# Altium project JEAC605UM-FTTSC-2.0.PRJPCB (part 1 of 3)
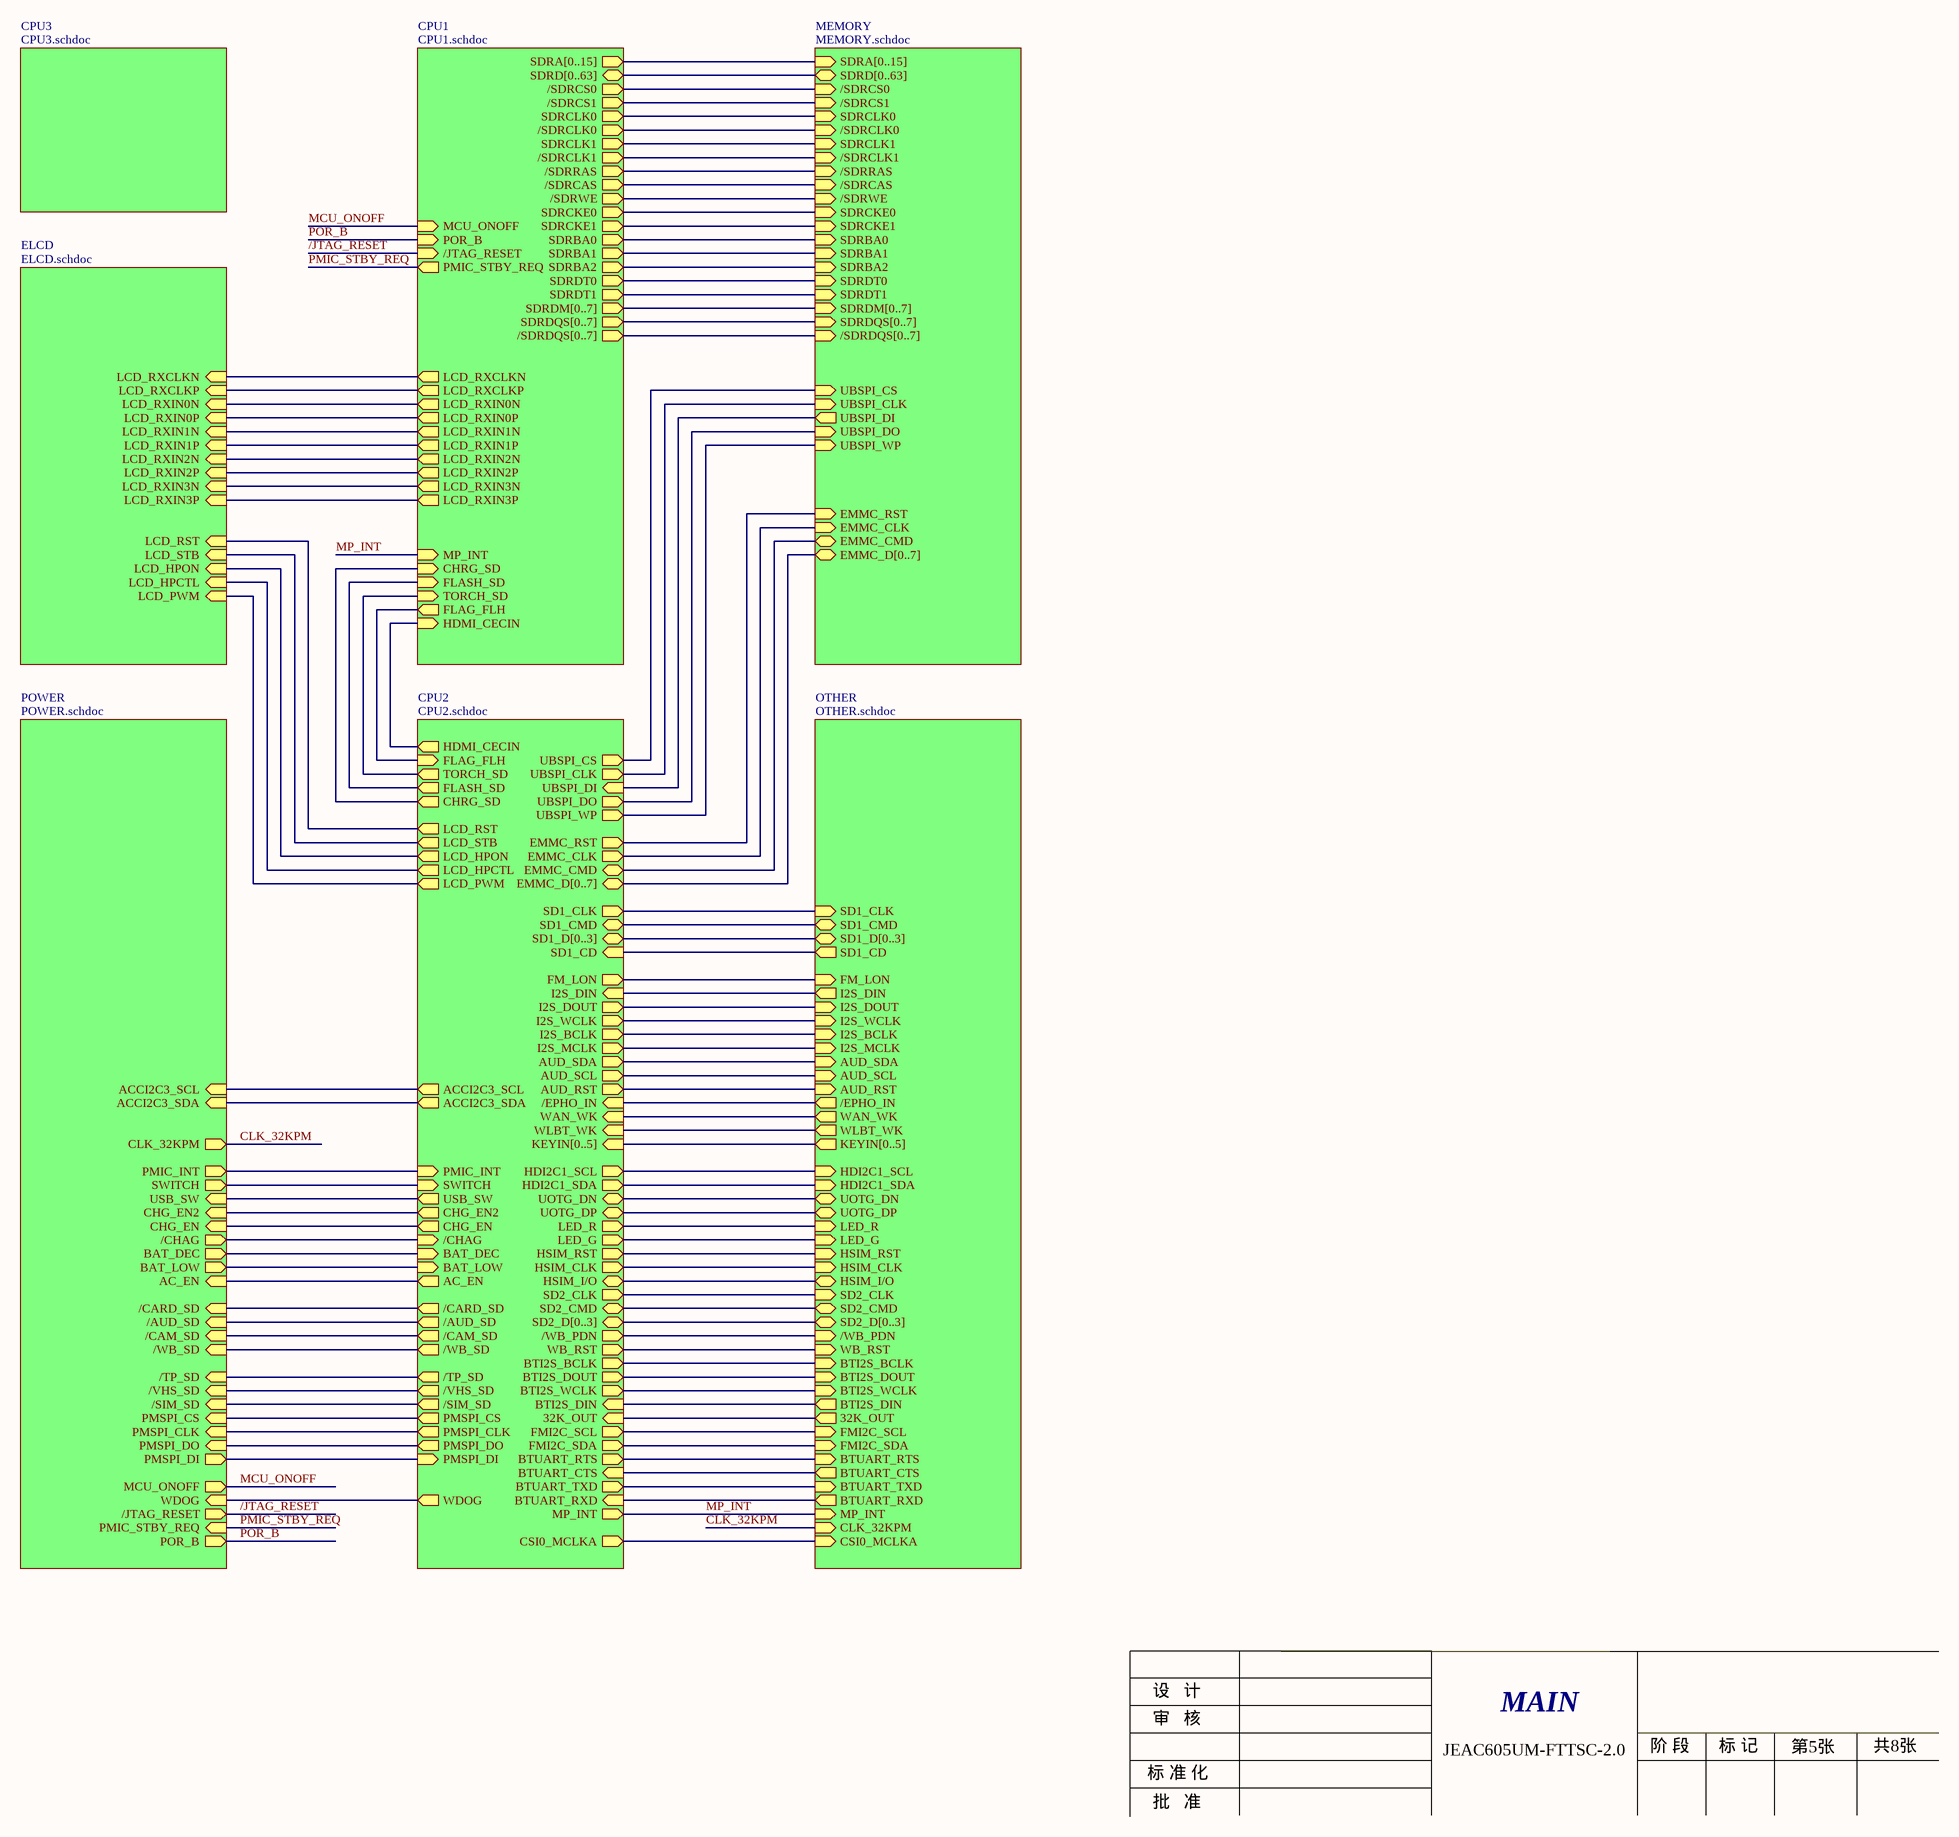
[diagram p0: MAIN.schdoc]
8 sheets, 865 parts. Net scope: hierarchical (ports join the sheet entries above them; power ports are global).
Sheets:
  MAIN.schdoc
    MEMORY = MEMORY.schdoc
    CPU1 = CPU1.schdoc
    CPU2 = CPU2.schdoc
    OTHER = OTHER.schdoc
    ELCD = ELCD.schdoc
    CPU3 = CPU3.schdoc
    POWER = POWER.schdoc

## Sheet MAIN.schdoc
size C; SheetNumber: 5; SheetTotal: 8

### Sub-sheets
CPU1 = CPU1.schdoc: /SDRCS0 (out), SDRCLK1 (out), /SDRCAS (out), /SDRRAS (out), /SDRWE (out), /SDRDQS[0..7] (out), /SDRCLK1 (out), SDRBA2 (out), SDRDQS[0..7] (out), SDRDM[0..7] (out), SDRCKE1 (out), SDRCKE0 (out), SDRA[0..15] (out), SDRD[0..63] (bidir), SDRBA0 (out), SDRBA1 (out), /JTAG_RESET (in), POR_B (in), SDRDT0 (out), SDRDT1 (out), PMIC_STBY_REQ (out), SDRCLK0 (out), /SDRCLK0 (out), LCD_RXCLKN (out), LCD_RXCLKP (out), LCD_RXIN0N (out), LCD_RXIN0P (out), LCD_RXIN1N (out), LCD_RXIN1P (out), LCD_RXIN2N (out), LCD_RXIN2P (out), LCD_RXIN3N (out), LCD_RXIN3P (out), HDMI_CECIN (in), /SDRCS1 (out), MCU_ONOFF (in), FLASH_SD (in), TORCH_SD (in), FLAG_FLH (out), CHRG_SD (in), MP_INT (in)  | Description: CPU1
CPU2 = CPU2.schdoc: /CAM_SD (out), /AUD_SD (out), /EPHO_IN (in), SWITCH (in), AUD_SDA (out), KEYIN[0..5] (in), SD2_CMD (bidir), SD2_D[0..3] (bidir), AUD_RST (out), UOTG_DN (bidir), AUD_SCL (out), I2S_DOUT (out), I2S_WCLK (out), UOTG_DP (bidir), /WB_PDN (out), /WB_SD (out), WB_RST (out), I2S_BCLK (out), I2S_MCLK (out), SD2_CLK (out), SD1_D[0..3] (bidir), SD1_CMD (bidir), SD1_CD (in), PMIC_INT (in), /VHS_SD (out), /TP_SD (out), SD1_CLK (out), WDOG (out), UBSPI_CS (out), UBSPI_DI (in), UBSPI_CLK (out), UBSPI_DO (out), UBSPI_WP (out), HSIM_RST (out), HSIM_I/O (bidir), HSIM_CLK (out), /CHAG (in), CHG_EN (out), /SIM_SD (out), LED_R (out), LED_G (out), BAT_DEC (in), EMMC_CLK (out), EMMC_CMD (bidir), EMMC_D[0..7] (bidir), EMMC_RST (out), USB_SW (out), CHG_EN2 (out), LCD_RST (out), LCD_HPON (out), LCD_STB (out), LCD_HPCTL (out), LCD_PWM (out), BTI2S_BCLK (out), BTI2S_DOUT (out), BTI2S_WCLK (out), BTI2S_DIN (in), FMI2C_SCL (out), FMI2C_SDA (out), /CARD_SD (out), 32K_OUT (in), WAN_WK (in), HDMI_CECIN (out), HDI2C1_SDA (out), HDI2C1_SCL (out), WLBT_WK (in), I2S_DIN (in), ACCI2C3_SCL (out), ACCI2C3_SDA (out), BAT_LOW (in), BTUART_RTS (out), BTUART_CTS (in), BTUART_TXD (out), BTUART_RXD (in), FM_LON (out), PMSPI_CS (out), PMSPI_CLK (out), PMSPI_DO (out), PMSPI_DI (in), AC_EN (out), FLAG_FLH (in), TORCH_SD (out), FLASH_SD (out), CHRG_SD (out), MP_INT (out), CSI0_MCLKA (out)  | Description: CPU2
CPU3 = CPU3.schdoc: no entries  | Description: epaper
ELCD = ELCD.schdoc: LCD_RXIN2P (in), LCD_RXIN3P (in), LCD_RXCLKP (in), LCD_RST (in), LCD_STB (in), LCD_PWM (in), LCD_RXCLKN (in), LCD_RXIN1N (in), LCD_RXIN1P (in), LCD_RXIN2N (in), LCD_RXIN3N (in), LCD_HPON (in), LCD_HPCTL (in), LCD_RXIN0N (in), LCD_RXIN0P (in)  | Description: epaper
MEMORY = MEMORY.schdoc: /SDRCS0 (in), /SDRRAS (in), /SDRCAS (in), /SDRCLK1 (in), SDRCLK1 (in), SDRDQS[0..7] (in), SDRDM[0..7] (in), /SDRWE (in), SDRCKE0 (in), SDRCKE1 (in), SDRA[0..15] (in), SDRD[0..63] (bidir), SDRBA0 (in), SDRBA1 (in), UBSPI_DI (out), UBSPI_CLK (in), UBSPI_WP (in), UBSPI_DO (in), UBSPI_CS (in), SDRBA2 (in), /SDRDQS[0..7] (in), /SDRCS1 (in), SDRDT0 (in), SDRDT1 (in), SDRCLK0 (in), /SDRCLK0 (in), EMMC_RST (in), EMMC_CLK (in), EMMC_D[0..7] (bidir), EMMC_CMD (bidir)  | Description: MEMORY
OTHER = OTHER.schdoc: AUD_SCL (in), SD2_D[0..3] (bidir), SD2_CMD (bidir), SD2_CLK (in), AUD_SDA (in), /EPHO_IN (out), KEYIN[0..5] (out), WB_RST (in), UOTG_DN (bidir), /WB_PDN (in), I2S_WCLK (in), I2S_BCLK (in), I2S_MCLK (in), I2S_DOUT (in), UOTG_DP (bidir), AUD_RST (in), SD1_CLK (in), SD1_D[0..3] (bidir), SD1_CMD (bidir), SD1_CD (out), HSIM_RST (in), HSIM_CLK (in), HSIM_I/O (bidir), LED_R (in), LED_G (in), BTI2S_BCLK (in), BTI2S_DOUT (in), BTI2S_WCLK (in), BTI2S_DIN (out), FMI2C_SCL (in), FMI2C_SDA (in), 32K_OUT (out), WAN_WK (out), WLBT_WK (out), I2S_DIN (out), BTUART_RTS (in), BTUART_CTS (out), BTUART_TXD (in), BTUART_RXD (out), FM_LON (in), CLK_32KPM (in), MP_INT (in), CSI0_MCLKA (in), HDI2C1_SCL (in), HDI2C1_SDA (in)  | Description: audio&CARD&KEY
POWER = POWER.schdoc: /JTAG_RESET (out), PMIC_STBY_REQ (in), POR_B (out), WDOG (in), SWITCH (out), /CAM_SD (in), /AUD_SD (in), /WB_SD (in), /TP_SD (in), /VHS_SD (in), PMIC_INT (out), /CHAG (out), CHG_EN (in), /SIM_SD (in), BAT_DEC (out), USB_SW (in), CHG_EN2 (in), /CARD_SD (in), MCU_ONOFF (out), ACCI2C3_SCL (in), ACCI2C3_SDA (in), BAT_LOW (out), PMSPI_DO (in), PMSPI_CLK (in), PMSPI_CS (in), PMSPI_DI (out), CLK_32KPM (out), AC_EN (in)  | Description: epaper

### Nets
32K_OUT: sheet CPU2/32K_OUT, sheet OTHER/32K_OUT
/AUD_SD: sheet CPU2//AUD_SD, sheet POWER//AUD_SD
/CAM_SD: sheet CPU2//CAM_SD, sheet POWER//CAM_SD
/CARD_SD: sheet CPU2//CARD_SD, sheet POWER//CARD_SD
/CHAG: sheet CPU2//CHAG, sheet POWER//CHAG
/EPHO_IN: sheet CPU2//EPHO_IN, sheet OTHER//EPHO_IN
/JTAG_RESET: sheet CPU1//JTAG_RESET, sheet POWER//JTAG_RESET
/SDRCAS: sheet MEMORY//SDRCAS, sheet CPU1//SDRCAS
/SDRCLK0: sheet MEMORY//SDRCLK0, sheet CPU1//SDRCLK0
/SDRCLK1: sheet MEMORY//SDRCLK1, sheet CPU1//SDRCLK1
/SDRCS0: sheet MEMORY//SDRCS0, sheet CPU1//SDRCS0
/SDRCS1: sheet MEMORY//SDRCS1, sheet CPU1//SDRCS1
/SDRRAS: sheet MEMORY//SDRRAS, sheet CPU1//SDRRAS
/SDRWE: sheet MEMORY//SDRWE, sheet CPU1//SDRWE
/SIM_SD: sheet CPU2//SIM_SD, sheet POWER//SIM_SD
/TP_SD: sheet CPU2//TP_SD, sheet POWER//TP_SD
/VHS_SD: sheet CPU2//VHS_SD, sheet POWER//VHS_SD
/WB_PDN: sheet CPU2//WB_PDN, sheet OTHER//WB_PDN
/WB_SD: sheet CPU2//WB_SD, sheet POWER//WB_SD
AC_EN: sheet CPU2/AC_EN, sheet POWER/AC_EN
ACCI2C3_SCL: sheet CPU2/ACCI2C3_SCL, sheet POWER/ACCI2C3_SCL
ACCI2C3_SDA: sheet CPU2/ACCI2C3_SDA, sheet POWER/ACCI2C3_SDA
AUD_RST: sheet CPU2/AUD_RST, sheet OTHER/AUD_RST
AUD_SCL: sheet CPU2/AUD_SCL, sheet OTHER/AUD_SCL
AUD_SDA: sheet CPU2/AUD_SDA, sheet OTHER/AUD_SDA
BAT_DEC: sheet CPU2/BAT_DEC, sheet POWER/BAT_DEC
BAT_LOW: sheet CPU2/BAT_LOW, sheet POWER/BAT_LOW
BTI2S_BCLK: sheet CPU2/BTI2S_BCLK, sheet OTHER/BTI2S_BCLK
BTI2S_DIN: sheet CPU2/BTI2S_DIN, sheet OTHER/BTI2S_DIN
BTI2S_DOUT: sheet CPU2/BTI2S_DOUT, sheet OTHER/BTI2S_DOUT
BTI2S_WCLK: sheet CPU2/BTI2S_WCLK, sheet OTHER/BTI2S_WCLK
BTUART_CTS: sheet CPU2/BTUART_CTS, sheet OTHER/BTUART_CTS
BTUART_RTS: sheet CPU2/BTUART_RTS, sheet OTHER/BTUART_RTS
BTUART_RXD: sheet CPU2/BTUART_RXD, sheet OTHER/BTUART_RXD
BTUART_TXD: sheet CPU2/BTUART_TXD, sheet OTHER/BTUART_TXD
CHG_EN: sheet CPU2/CHG_EN, sheet POWER/CHG_EN
CHG_EN2: sheet CPU2/CHG_EN2, sheet POWER/CHG_EN2
CHRG_SD: sheet CPU1/CHRG_SD, sheet CPU2/CHRG_SD
CLK_32KPM: sheet OTHER/CLK_32KPM, sheet POWER/CLK_32KPM
CSI0_MCLKA: sheet CPU2/CSI0_MCLKA, sheet OTHER/CSI0_MCLKA
EMMC_CLK: sheet MEMORY/EMMC_CLK, sheet CPU2/EMMC_CLK
EMMC_CMD: sheet MEMORY/EMMC_CMD, sheet CPU2/EMMC_CMD
EMMC_RST: sheet MEMORY/EMMC_RST, sheet CPU2/EMMC_RST
FLAG_FLH: sheet CPU1/FLAG_FLH, sheet CPU2/FLAG_FLH
FLASH_SD: sheet CPU1/FLASH_SD, sheet CPU2/FLASH_SD
FM_LON: sheet CPU2/FM_LON, sheet OTHER/FM_LON
FMI2C_SCL: sheet CPU2/FMI2C_SCL, sheet OTHER/FMI2C_SCL
FMI2C_SDA: sheet CPU2/FMI2C_SDA, sheet OTHER/FMI2C_SDA
HDI2C1_SCL: sheet CPU2/HDI2C1_SCL, sheet OTHER/HDI2C1_SCL
HDI2C1_SDA: sheet CPU2/HDI2C1_SDA, sheet OTHER/HDI2C1_SDA
HDMI_CECIN: sheet CPU1/HDMI_CECIN, sheet CPU2/HDMI_CECIN
HSIM_CLK: sheet CPU2/HSIM_CLK, sheet OTHER/HSIM_CLK
HSIM_I/O: sheet CPU2/HSIM_I/O, sheet OTHER/HSIM_I/O
HSIM_RST: sheet CPU2/HSIM_RST, sheet OTHER/HSIM_RST
I2S_BCLK: sheet CPU2/I2S_BCLK, sheet OTHER/I2S_BCLK
I2S_DIN: sheet CPU2/I2S_DIN, sheet OTHER/I2S_DIN
I2S_DOUT: sheet CPU2/I2S_DOUT, sheet OTHER/I2S_DOUT
I2S_MCLK: sheet CPU2/I2S_MCLK, sheet OTHER/I2S_MCLK
I2S_WCLK: sheet CPU2/I2S_WCLK, sheet OTHER/I2S_WCLK
LCD_HPCTL: sheet CPU2/LCD_HPCTL, sheet ELCD/LCD_HPCTL
LCD_HPON: sheet CPU2/LCD_HPON, sheet ELCD/LCD_HPON
LCD_PWM: sheet CPU2/LCD_PWM, sheet ELCD/LCD_PWM
LCD_RST: sheet CPU2/LCD_RST, sheet ELCD/LCD_RST
LCD_RXCLKN: sheet CPU1/LCD_RXCLKN, sheet ELCD/LCD_RXCLKN
LCD_RXCLKP: sheet CPU1/LCD_RXCLKP, sheet ELCD/LCD_RXCLKP
LCD_RXIN0N: sheet CPU1/LCD_RXIN0N, sheet ELCD/LCD_RXIN0N
LCD_RXIN0P: sheet CPU1/LCD_RXIN0P, sheet ELCD/LCD_RXIN0P
LCD_RXIN1N: sheet CPU1/LCD_RXIN1N, sheet ELCD/LCD_RXIN1N
LCD_RXIN1P: sheet CPU1/LCD_RXIN1P, sheet ELCD/LCD_RXIN1P
LCD_RXIN2N: sheet CPU1/LCD_RXIN2N, sheet ELCD/LCD_RXIN2N
LCD_RXIN2P: sheet CPU1/LCD_RXIN2P, sheet ELCD/LCD_RXIN2P
LCD_RXIN3N: sheet CPU1/LCD_RXIN3N, sheet ELCD/LCD_RXIN3N
LCD_RXIN3P: sheet CPU1/LCD_RXIN3P, sheet ELCD/LCD_RXIN3P
LCD_STB: sheet CPU2/LCD_STB, sheet ELCD/LCD_STB
LED_G: sheet CPU2/LED_G, sheet OTHER/LED_G
LED_R: sheet CPU2/LED_R, sheet OTHER/LED_R
MCU_ONOFF: sheet CPU1/MCU_ONOFF, sheet POWER/MCU_ONOFF
MP_INT: sheet CPU1/MP_INT, sheet CPU2/MP_INT, sheet OTHER/MP_INT
PMIC_INT: sheet CPU2/PMIC_INT, sheet POWER/PMIC_INT
PMIC_STBY_REQ: sheet CPU1/PMIC_STBY_REQ, sheet POWER/PMIC_STBY_REQ
PMSPI_CLK: sheet CPU2/PMSPI_CLK, sheet POWER/PMSPI_CLK
PMSPI_CS: sheet CPU2/PMSPI_CS, sheet POWER/PMSPI_CS
PMSPI_DI: sheet CPU2/PMSPI_DI, sheet POWER/PMSPI_DI
PMSPI_DO: sheet CPU2/PMSPI_DO, sheet POWER/PMSPI_DO
POR_B: sheet CPU1/POR_B, sheet POWER/POR_B
SD1_CD: sheet CPU2/SD1_CD, sheet OTHER/SD1_CD
SD1_CLK: sheet CPU2/SD1_CLK, sheet OTHER/SD1_CLK
SD1_CMD: sheet CPU2/SD1_CMD, sheet OTHER/SD1_CMD
SD2_CLK: sheet CPU2/SD2_CLK, sheet OTHER/SD2_CLK
SD2_CMD: sheet CPU2/SD2_CMD, sheet OTHER/SD2_CMD
SDRBA0: sheet MEMORY/SDRBA0, sheet CPU1/SDRBA0
SDRBA1: sheet MEMORY/SDRBA1, sheet CPU1/SDRBA1
SDRBA2: sheet MEMORY/SDRBA2, sheet CPU1/SDRBA2
SDRCKE0: sheet MEMORY/SDRCKE0, sheet CPU1/SDRCKE0
SDRCKE1: sheet MEMORY/SDRCKE1, sheet CPU1/SDRCKE1
SDRCLK0: sheet MEMORY/SDRCLK0, sheet CPU1/SDRCLK0
SDRCLK1: sheet MEMORY/SDRCLK1, sheet CPU1/SDRCLK1
SDRDT0: sheet MEMORY/SDRDT0, sheet CPU1/SDRDT0
SDRDT1: sheet MEMORY/SDRDT1, sheet CPU1/SDRDT1
SWITCH: sheet CPU2/SWITCH, sheet POWER/SWITCH
TORCH_SD: sheet CPU1/TORCH_SD, sheet CPU2/TORCH_SD
UBSPI_CLK: sheet MEMORY/UBSPI_CLK, sheet CPU2/UBSPI_CLK
UBSPI_CS: sheet MEMORY/UBSPI_CS, sheet CPU2/UBSPI_CS
UBSPI_DI: sheet MEMORY/UBSPI_DI, sheet CPU2/UBSPI_DI
UBSPI_DO: sheet MEMORY/UBSPI_DO, sheet CPU2/UBSPI_DO
UBSPI_WP: sheet MEMORY/UBSPI_WP, sheet CPU2/UBSPI_WP
UOTG_DN: sheet CPU2/UOTG_DN, sheet OTHER/UOTG_DN
UOTG_DP: sheet CPU2/UOTG_DP, sheet OTHER/UOTG_DP
USB_SW: sheet CPU2/USB_SW, sheet POWER/USB_SW
WAN_WK: sheet CPU2/WAN_WK, sheet OTHER/WAN_WK
WB_RST: sheet CPU2/WB_RST, sheet OTHER/WB_RST
WDOG: sheet CPU2/WDOG, sheet POWER/WDOG
WLBT_WK: sheet CPU2/WLBT_WK, sheet OTHER/WLBT_WK

### Buses and harness runs
bus sheet CPU1//SDRDQS[0..7] = sheet MEMORY//SDRDQS[0..7]
bus sheet CPU1/SDRA[0..15] = sheet MEMORY/SDRA[0..15]
bus sheet CPU1/SDRD[0..63] = sheet MEMORY/SDRD[0..63]
bus sheet CPU1/SDRDM[0..7] = sheet MEMORY/SDRDM[0..7]
bus sheet CPU1/SDRDQS[0..7] = sheet MEMORY/SDRDQS[0..7]
bus sheet CPU2/EMMC_D[0..7] = sheet MEMORY/EMMC_D[0..7]
bus sheet CPU2/KEYIN[0..5] = sheet OTHER/KEYIN[0..5]
bus sheet CPU2/SD1_D[0..3] = sheet OTHER/SD1_D[0..3]
bus sheet CPU2/SD2_D[0..3] = sheet OTHER/SD2_D[0..3]

### Notes on the sheet
- 设   计
- 审   核
- MAIN
- 标 准 化
- 批   准
- JEAC605UM-FTTSC-2.0
- 阶 段
- 标 记
- 第5张
- 共8张

## Sheet MEMORY.schdoc
size D; SheetNumber: 6; SheetTotal: 8
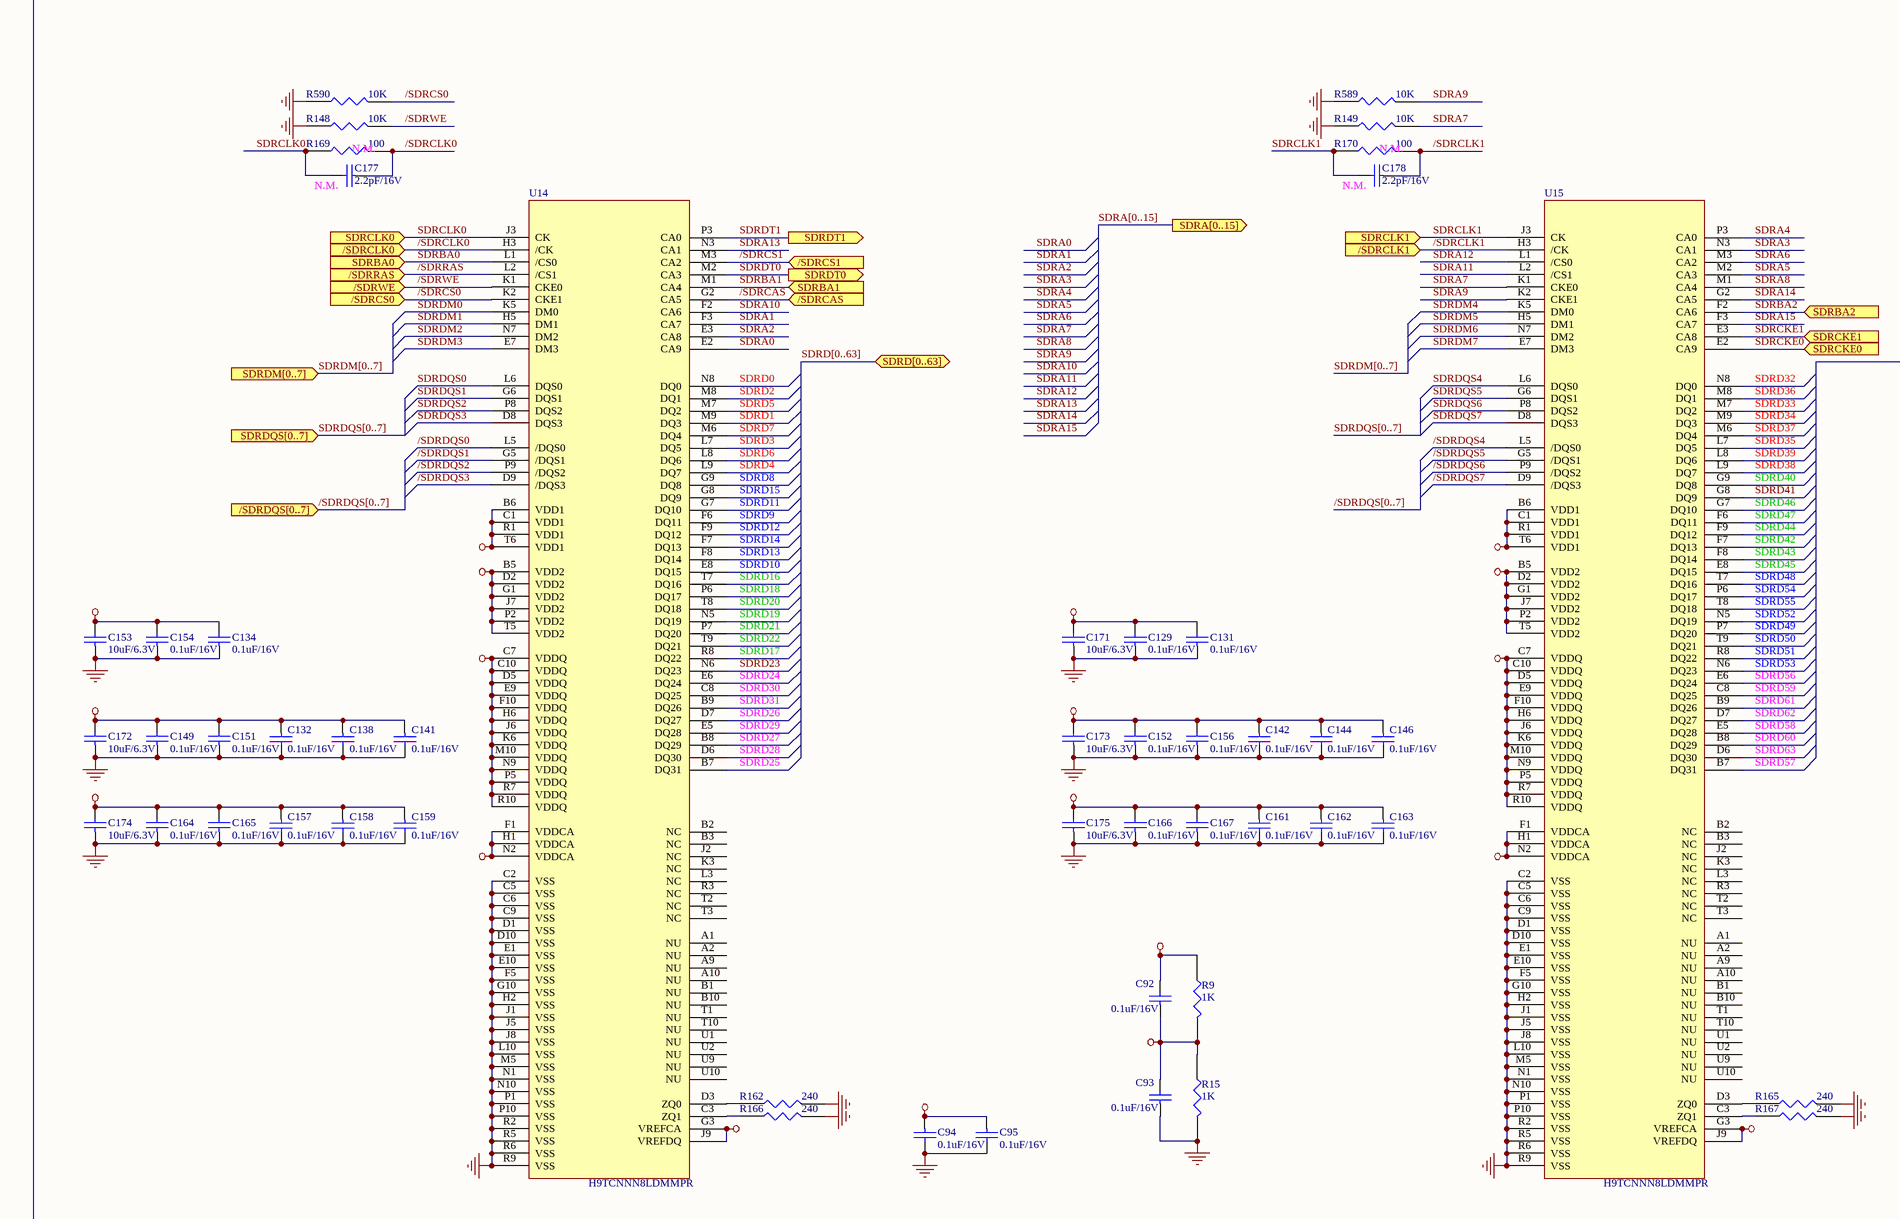
[diagram p1: MEMORY.schdoc, top left]
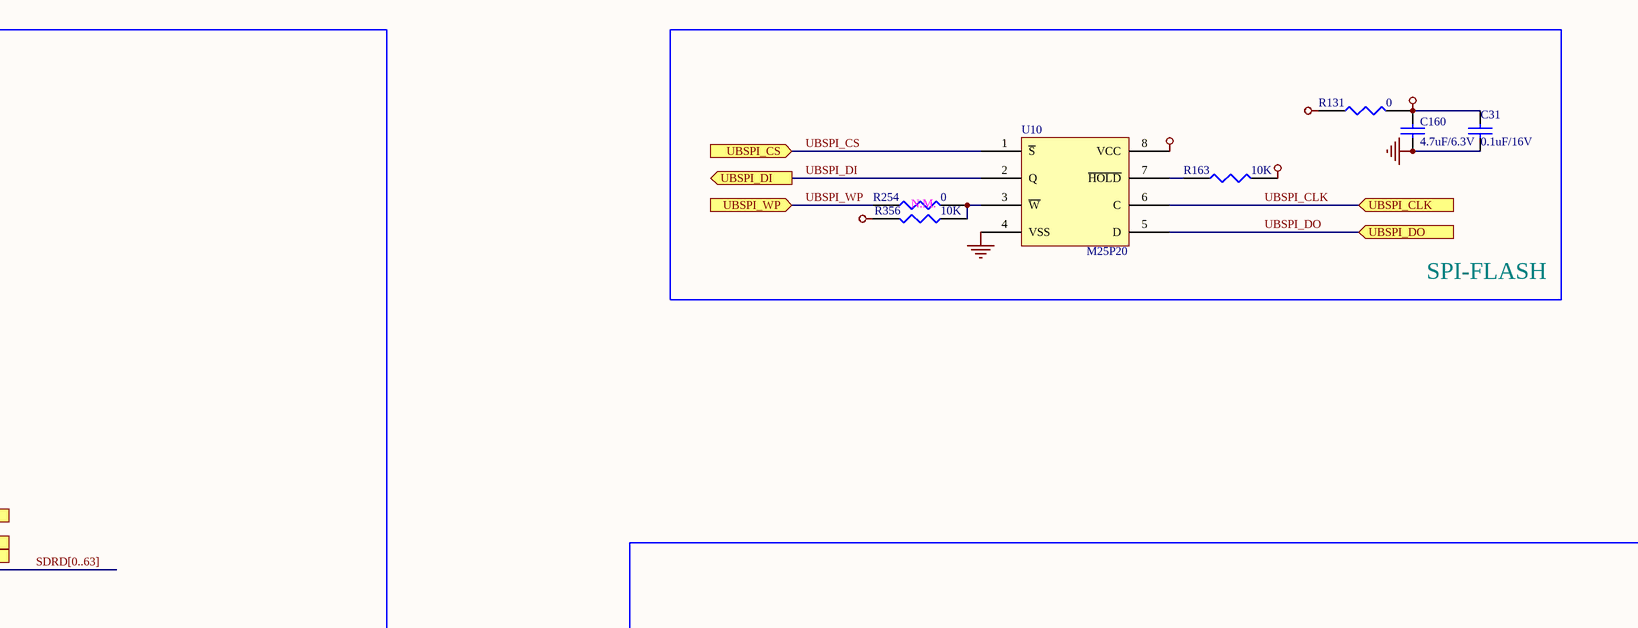
[diagram p2: MEMORY.schdoc, top right]
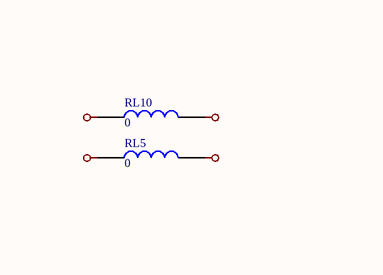
[diagram p3: MEMORY.schdoc, bottom left]
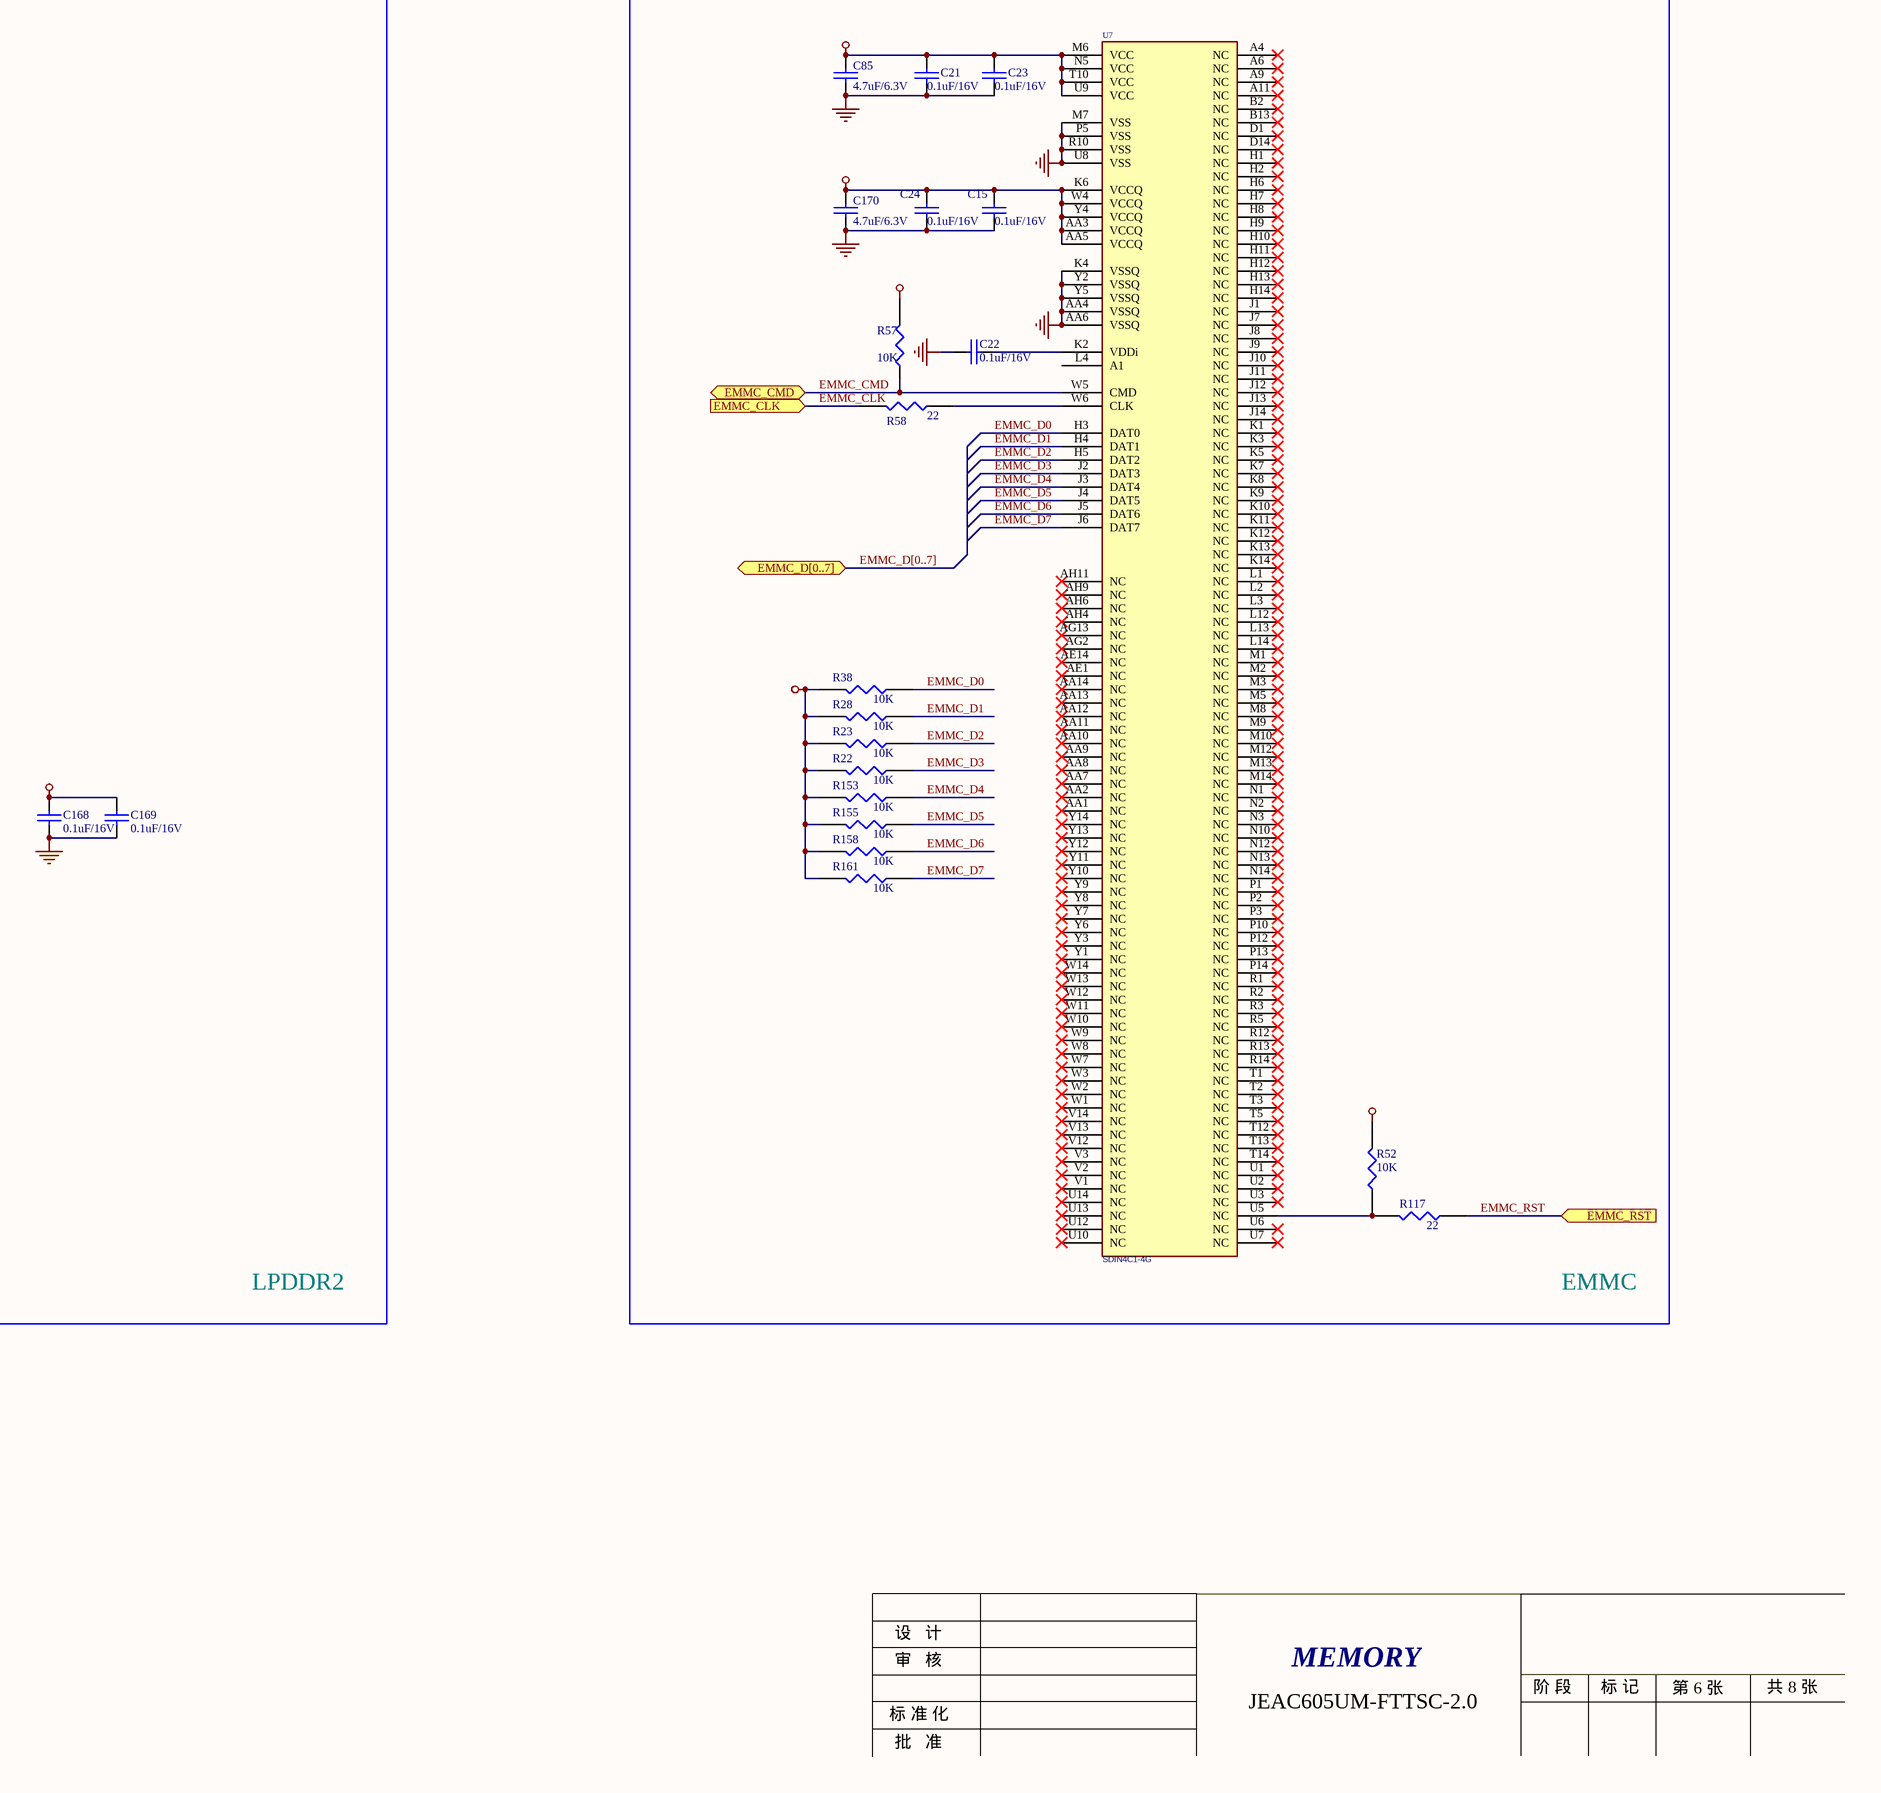
[diagram p4: MEMORY.schdoc, bottom right]

### Parts
C15  0.1uF/16V  [C0402]
C21  0.1uF/16V  [C0402]
C22  0.1uF/16V  [C0402]
C23  0.1uF/16V  [C0402]
C24  0.1uF/16V  [C0402]
C31  0.1uF/16V  [C0402]
C85  4.7uF/6.3V  [C0603]
C92  0.1uF/16V  [C0402]
C93  0.1uF/16V  [C0402]
C94  0.1uF/16V  [C0402]
C95  0.1uF/16V  [C0402]
C129  0.1uF/16V  [C0402]
C131  0.1uF/16V  [C0402]
C132  0.1uF/16V  [C0402]
C134  0.1uF/16V  [C0402]
C138  0.1uF/16V  [C0402]
C141  0.1uF/16V  [C0402]
C142  0.1uF/16V  [C0402]
C144  0.1uF/16V  [C0402]
C146  0.1uF/16V  [C0402]
C149  0.1uF/16V  [C0402]
C151  0.1uF/16V  [C0402]
C152  0.1uF/16V  [C0402]
C153  10uF/6.3V  [C0603]
C154  0.1uF/16V  [C0402]
C156  0.1uF/16V  [C0402]
C157  0.1uF/16V  [C0402]
C158  0.1uF/16V  [C0402]
C159  0.1uF/16V  [C0402]
C160  4.7uF/6.3V  [C0603]
C161  0.1uF/16V  [C0402]
C162  0.1uF/16V  [C0402]
C163  0.1uF/16V  [C0402]
C164  0.1uF/16V  [C0402]
C165  0.1uF/16V  [C0402]
C166  0.1uF/16V  [C0402]
C167  0.1uF/16V  [C0402]
C168  0.1uF/16V  [C0402]
C169  0.1uF/16V  [C0402]
C170  4.7uF/6.3V  [C0603]
C171  10uF/6.3V  [C0603]
C172  10uF/6.3V  [C0603]
C173  10uF/6.3V  [C0603]
C174  10uF/6.3V  [C0603]
C175  10uF/6.3V  [C0603]
C177  2.2pF/16V  [C0402]
C178  2.2pF/16V  [C0402]
R9  1K  [R0402]
R15  1K  [R0402]
R22  10K  [R0402]
R23  10K  [R0402]
R28  10K  [R0402]
R38  10K  [R0402]
R52  10K  [R0402]
R57  10K  [R0402]
R58  22  [R0402]
R117  22  [R0402]
R131  0  [R0402]
R148  10K  [R0402]
R149  10K  [R0402]
R153  10K  [R0402]
R155  10K  [R0402]
R158  10K  [R0402]
R161  10K  [R0402]
R162  240  [R0402]
R163  10K  [R0402]
R165  240  [R0402]
R166  240  [R0402]
R167  240  [R0402]
R169  100  [R0402]
R170  100  [R0402]
R254  0  [R0402]
R356  10K  [R0402]
R589  10K  [R0402]
R590  10K  [R0402]
RL5  0  [L0603]
RL10  0  [L0603]
U7  SDIN4C1-4G  [U-FBGA-169-0_5]
U10  M25P20  [U-SO-8-1_27]
U14  H9TCNNN8LDMMPR  [U-FBGA-134-0_65]
U15  H9TCNNN8LDMMPR  [U-FBGA-134-0_65]

### Blocks framed on the sheet
LPDDR2: C92-C95 C129 C131 C132 C134 C138 C141 C142 C144 C146 C149 C151-C154 C156-C159 C161-C169 C171-C175 C177 C178 R9 R15 R148 R149 R162 R165-R167 R169 R170 R589 R590 RL5 RL10 U14 U15
SPI-FLASH: C31 C160 R131 R163 R254 R356 U10
EMMC: C15 C21-C24 C85 C170 R22 R23 R28 R38 R52 R57 R58 R117 R153 R155 R158 R161 U7

### Ports
/SDRCAS (in), /SDRCLK0 (in), /SDRCLK1 (in), /SDRCS0 (in), /SDRCS1 (in), /SDRDQS[0..7] (in), /SDRRAS (in), /SDRWE (in), EMMC_CLK (in), EMMC_CMD (bidir), EMMC_D[0..7] (bidir), EMMC_RST (in), SDRA[0..15] (out), SDRBA0 (in), SDRBA1 (in), SDRBA2 (in), SDRCKE0 (in), SDRCKE1 (in), SDRCLK0 (in), SDRCLK1 (in), SDRD[0..63] (bidir), SDRDM[0..7] (in), SDRDQS[0..7] (in), SDRDT0 (out), SDRDT1 (out), UBSPI_CLK (in), UBSPI_CS (in), UBSPI_DI (out), UBSPI_DO (in), UBSPI_WP (in)

### Nets
DRAM_VREF: C92.1 C93.2 C94.1 C95.1 C168.1 C169.1 R9.2 R15.1 U14.G3(VREFCA) U14.J9(VREFDQ) U15.G3(VREFCA) U15.J9(VREFDQ)
GND: C15.1 C21.1 C22.1 C23.1 C24.1 C31.1 C85.2 C93.1 C94.2 C95.2 C129.1 C131.1 C132.2 C134.1 C138.2 C141.2 C142.2 C144.2 C146.2 C149.1 C151.1 C152.1 C153.1 C154.1 C156.1 C157.2 C158.2 C159.2 C160.2 C161.2 C162.2 C163.2 C164.1 C165.1 C166.1 C167.1 C168.2 C169.2 C170.2 C171.1 C172.1 C173.1 C174.1 C175.1 R15.2 R148.1 R149.1 R162.2 R165.2 R166.2 R167.2 R589.1 R590.1 U7.AA4(VSSQ) U7.AA6(VSSQ) U7.K4(VSSQ) U7.M7(VSS) U7.P5(VSS) U7.R10(VSS) U7.U8(VSS) U7.Y2(VSSQ) U7.Y5(VSSQ) U10.4(VSS) U14.C2(VSS) U14.C5(VSS) U14.C6(VSS) U14.C9(VSS) U14.D1(VSS) U14.D10(VSS) U14.E1(VSS) U14.E10(VSS) U14.F5(VSS) U14.G10(VSS) U14.H2(VSS) U14.J1(VSS) U14.J5(VSS) U14.J8(VSS) U14.L10(VSS) U14.M5(VSS) U14.N1(VSS) U14.N10(VSS) U14.P1(VSS) U14.P10(VSS) U14.R2(VSS) U14.R5(VSS) U14.R6(VSS) U14.R9(VSS) U15.C2(VSS) U15.C5(VSS) U15.C6(VSS) U15.C9(VSS) U15.D1(VSS) U15.D10(VSS) U15.E1(VSS) U15.E10(VSS) U15.F5(VSS) U15.G10(VSS) U15.H2(VSS) U15.J1(VSS) U15.J5(VSS) U15.J8(VSS) U15.L10(VSS) U15.M5(VSS) U15.N1(VSS) U15.N10(VSS) U15.P1(VSS) U15.P10(VSS) U15.R2(VSS) U15.R5(VSS) U15.R6(VSS) U15.R9(VSS)
VCC_1V8: RL5.2
VCC_3V: C15.2 C21.2 C23.2 C24.2 C85.1 C170.1 R22.2 R23.2 R28.2 R38.2 R52.2 R57.2 R131.1 R153.2 R155.2 R158.2 R161.2 U7.AA3(VCCQ) U7.AA5(VCCQ) U7.K6(VCCQ) U7.M6(VCC) U7.N5(VCC) U7.T10(VCC) U7.U9(VCC) U7.W4(VCCQ) U7.Y4(VCCQ)
VDD_DRAM_1.2V: C92.2 C132.1 C138.1 C141.1 C142.1 C144.1 C146.1 C149.2 C151.2 C152.2 C156.2 C157.1 C158.1 C159.1 C161.1 C162.1 C163.1 C164.2 C165.2 C166.2 C167.2 C172.2 C173.2 C174.2 C175.2 R9.1 RL10.1 U14.B5(VDD2) U14.C7(VDDQ) U14.C10(VDDQ) U14.D2(VDD2) U14.D5(VDDQ) U14.E9(VDDQ) U14.F1(VDDCA) U14.F10(VDDQ) U14.G1(VDD2) U14.H1(VDDCA) U14.H6(VDDQ) U14.J6(VDDQ) U14.J7(VDD2) U14.K6(VDDQ) U14.M10(VDDQ) U14.N2(VDDCA) U14.N9(VDDQ) U14.P2(VDD2) U14.P5(VDDQ) U14.R7(VDDQ) U14.R10(VDDQ) U14.T5(VDD2) U15.B5(VDD2) U15.C7(VDDQ) U15.C10(VDDQ) U15.D2(VDD2) U15.D5(VDDQ) U15.E9(VDDQ) U15.F1(VDDCA) U15.F10(VDDQ) U15.G1(VDD2) U15.H1(VDDCA) U15.H6(VDDQ) U15.J6(VDDQ) U15.J7(VDD2) U15.K6(VDDQ) U15.M10(VDDQ) U15.N2(VDDCA) U15.N9(VDDQ) U15.P2(VDD2) U15.P5(VDDQ) U15.R7(VDDQ) U15.R10(VDDQ) U15.T5(VDD2)
VDD_DRAM_1.8V: C129.2 C131.2 C134.2 C153.2 C154.2 C171.2 RL5.1 U14.B6(VDD1) U14.C1(VDD1) U14.R1(VDD1) U14.T6(VDD1) U15.B6(VDD1) U15.C1(VDD1) U15.R1(VDD1) U15.T6(VDD1)
VDD_SDR_1.2V: RL10.2
VDD_UBSPI: C31.2 C160.1 R131.2 R163.2 R356.2 U10.8(VCC)
/SDRCAS: U14.G2(CA5) ; port /SDRCAS
/SDRCLK0: C177.1 R169.2 U14.H3(/CK) ; port /SDRCLK0
/SDRCLK1: C178.1 R170.2 U15.H3(/CK) ; port /SDRCLK1
/SDRCS0: R590.2 U14.K2(CKE1) ; port /SDRCS0
/SDRCS1: U14.M3(CA2) ; port /SDRCS1
/SDRDQS0: U14.L5(/DQS0)
/SDRDQS1: U14.G5(/DQS1)
/SDRDQS2: U14.P9(/DQS2)
/SDRDQS3: U14.D9(/DQS3)
/SDRDQS4: U15.L5(/DQS0)
/SDRDQS5: U15.G5(/DQS1)
/SDRDQS6: U15.P9(/DQS2)
/SDRDQS7: U15.D9(/DQS3)
/SDRRAS: U14.L2(/CS1) ; port /SDRRAS
/SDRWE: R148.2 U14.K1(CKE0) ; port /SDRWE
EMMC_CLK: R58.2 ; port EMMC_CLK
EMMC_CMD: R57.1 U7.W5(CMD) ; port EMMC_CMD
EMMC_D0: R38.1 U7.H3(DAT0)
EMMC_D1: R28.1 U7.H4(DAT1)
EMMC_D2: R23.1 U7.H5(DAT2)
EMMC_D3: R22.1 U7.J2(DAT3)
EMMC_D4: R153.1 U7.J3(DAT4)
EMMC_D5: R155.1 U7.J4(DAT5)
EMMC_D6: R158.1 U7.J5(DAT6)
EMMC_D7: R161.1 U7.J6(DAT7)
EMMC_RST: R117.1 ; port EMMC_RST
SDRA0: U14.E2(CA9)
SDRA1: U14.F3(CA7)
SDRA2: U14.E3(CA8)
SDRA3: U15.N3(CA1)
SDRA4: U15.P3(CA0)
SDRA5: U15.M2(CA3)
SDRA6: U15.M3(CA2)
SDRA7: R149.2 U15.K1(CKE0)
SDRA8: U15.M1(CA4)
SDRA9: R589.2 U15.K2(CKE1)
SDRA10: U14.F2(CA6)
SDRA11: U15.L2(/CS1)
SDRA12: U15.L1(/CS0)
SDRA13: U14.N3(CA1)
SDRA14: U15.G2(CA5)
SDRA15: U15.F3(CA7)
SDRBA0: U14.L1(/CS0) ; port SDRBA0
SDRBA1: U14.M1(CA4) ; port SDRBA1
SDRBA2: U15.F2(CA6) ; port SDRBA2
SDRCKE0: U15.E2(CA9) ; port SDRCKE0
SDRCKE1: U15.E3(CA8) ; port SDRCKE1
SDRCLK0: C177.2 R169.1 U14.J3(CK) ; port SDRCLK0
SDRCLK1: C178.2 R170.1 U15.J3(CK) ; port SDRCLK1
SDRD0: U14.N8(DQ0)
SDRD1: U14.M9(DQ3)
SDRD2: U14.M8(DQ1)
SDRD3: U14.L7(DQ5)
SDRD4: U14.L9(DQ7)
SDRD5: U14.M7(DQ2)
SDRD6: U14.L8(DQ6)
SDRD7: U14.M6(DQ4)
SDRD8: U14.G9(DQ8)
SDRD9: U14.F6(DQ11)
SDRD10: U14.E8(DQ15)
SDRD11: U14.G7(DQ10)
SDRD12: U14.F9(DQ12)
SDRD13: U14.F8(DQ14)
SDRD14: U14.F7(DQ13)
SDRD15: U14.G8(DQ9)
SDRD16: U14.T7(DQ16)
SDRD17: U14.R8(DQ22)
SDRD18: U14.P6(DQ17)
SDRD19: U14.N5(DQ19)
SDRD20: U14.T8(DQ18)
SDRD21: U14.P7(DQ20)
SDRD22: U14.T9(DQ21)
SDRD23: U14.N6(DQ23)
SDRD24: U14.E6(DQ24)
SDRD25: U14.B7(DQ31)
SDRD26: U14.D7(DQ27)
SDRD27: U14.B8(DQ29)
SDRD28: U14.D6(DQ30)
SDRD29: U14.E5(DQ28)
SDRD30: U14.C8(DQ25)
SDRD31: U14.B9(DQ26)
SDRD32: U15.N8(DQ0)
SDRD33: U15.M7(DQ2)
SDRD34: U15.M9(DQ3)
SDRD35: U15.L7(DQ5)
SDRD36: U15.M8(DQ1)
SDRD37: U15.M6(DQ4)
SDRD38: U15.L9(DQ7)
SDRD39: U15.L8(DQ6)
SDRD40: U15.G9(DQ8)
SDRD41: U15.G8(DQ9)
SDRD42: U15.F7(DQ13)
SDRD43: U15.F8(DQ14)
SDRD44: U15.F9(DQ12)
SDRD45: U15.E8(DQ15)
SDRD46: U15.G7(DQ10)
SDRD47: U15.F6(DQ11)
SDRD48: U15.T7(DQ16)
SDRD49: U15.P7(DQ20)
SDRD50: U15.T9(DQ21)
SDRD51: U15.R8(DQ22)
SDRD52: U15.N5(DQ19)
SDRD53: U15.N6(DQ23)
SDRD54: U15.P6(DQ17)
SDRD55: U15.T8(DQ18)
SDRD56: U15.E6(DQ24)
SDRD57: U15.B7(DQ31)
SDRD58: U15.E5(DQ28)
SDRD59: U15.C8(DQ25)
SDRD60: U15.B8(DQ29)
SDRD61: U15.B9(DQ26)
SDRD62: U15.D7(DQ27)
SDRD63: U15.D6(DQ30)
SDRDM0: U14.K5(DM0)
SDRDM1: U14.H5(DM1)
SDRDM2: U14.N7(DM2)
SDRDM3: U14.E7(DM3)
SDRDM4: U15.K5(DM0)
SDRDM5: U15.H5(DM1)
SDRDM6: U15.N7(DM2)
SDRDM7: U15.E7(DM3)
SDRDQS0: U14.L6(DQS0)
SDRDQS1: U14.G6(DQS1)
SDRDQS2: U14.P8(DQS2)
SDRDQS3: U14.D8(DQS3)
SDRDQS4: U15.L6(DQS0)
SDRDQS5: U15.G6(DQS1)
SDRDQS6: U15.P8(DQS2)
SDRDQS7: U15.D8(DQS3)
SDRDT0: U14.M2(CA3) ; port SDRDT0
SDRDT1: U14.P3(CA0) ; port SDRDT1
UBSPI_CLK: U10.6(C) ; port UBSPI_CLK
UBSPI_CS: U10.1(~{S}) ; port UBSPI_CS
UBSPI_DI: U10.2(Q) ; port UBSPI_DI
UBSPI_DO: U10.5(D) ; port UBSPI_DO
UBSPI_WP: R254.1 ; port UBSPI_WP
NetC22_2: C22.2 U7.K2(VDDi)
NetR52_1: R52.1 R117.2 U7.U5(NC)
NetR58_1: R58.1 U7.W6(CLK)
NetR162_1: R162.1 U14.D3(ZQ0)
NetR163_1: R163.1 U10.7(~{HOLD})
NetR165_1: R165.1 U15.D3(ZQ0)
NetR166_1: R166.1 U14.C3(ZQ1)
NetR167_1: R167.1 U15.C3(ZQ1)
NetR254_2: R254.2 R356.1 U10.3(~{W})

Not connected (* = marked no-connect by the designer): U7 A4(NC)* A6(NC)* A9(NC)* A11(NC)* AA1(NC)* AA2(NC)* AA7(NC)* AA8(NC)* AA9(NC)* AA10(NC)* AA11(NC)* AA12(NC)* AA13(NC)* AA14(NC)* AE1(NC)* AE14(NC)* AG2(NC)* AG13(NC)* AH4(NC)* AH6(NC)* AH9(NC)* AH11(NC)* B2(NC)* B13(NC)* D1(NC)* D14(NC)* H1(NC)* H2(NC)* H6(NC)* H7(NC)* H8(NC)* H9(NC)* H10(NC)* H11(NC)* H12(NC)* H13(NC)* H14(NC)* J1(NC)* J7(NC)* J8(NC)* J9(NC)* J10(NC)* J11(NC)* J12(NC)* J13(NC)* J14(NC)* K1(NC)* K3(NC)* K5(NC)* K7(NC)* K8(NC)* K9(NC)* K10(NC)* K11(NC)* K12(NC)* K13(NC)* K14(NC)* L1(NC)* L2(NC)* L3(NC)* L4(A1) L12(NC)* L13(NC)* L14(NC)* M1(NC)* M2(NC)* M3(NC)* M5(NC)* M8(NC)* M9(NC)* M10(NC)* M12(NC)* M13(NC)* M14(NC)* N1(NC)* N2(NC)* N3(NC)* N10(NC)* N12(NC)* N13(NC)* N14(NC)* P1(NC)* P2(NC)* P3(NC)* P10(NC)* P12(NC)* P13(NC)* P14(NC)* R1(NC)* R2(NC)* R3(NC)* R5(NC)* R12(NC)* R13(NC)* R14(NC)* T1(NC)* T2(NC)* T3(NC)* T5(NC)* T12(NC)* T13(NC)* T14(NC)* U1(NC)* U2(NC)* U3(NC)* U6(NC)* U7(NC)* U10(NC)* U12(NC)* U13(NC)* U14(NC)* V1(NC)* V2(NC)* V3(NC)* V12(NC)* V13(NC)* V14(NC)* W1(NC)* W2(NC)* W3(NC)* W7(NC)* W8(NC)* W9(NC)* W10(NC)* W11(NC)* W12(NC)* W13(NC)* W14(NC)* Y1(NC)* Y3(NC)* Y6(NC)* Y7(NC)* Y8(NC)* Y9(NC)* Y10(NC)* Y11(NC)* Y12(NC)* Y13(NC)* Y14(NC)*; U14 A1(NU) A2(NU) A9(NU) A10(NU) B1(NU) B2(NC) B3(NC) B10(NU) J2(NC) K3(NC) L3(NC) R3(NC) T1(NU) T2(NC) T3(NC) T10(NU) U1(NU) U2(NU) U9(NU) U10(NU); U15 A1(NU) A2(NU) A9(NU) A10(NU) B1(NU) B2(NC) B3(NC) B10(NU) J2(NC) K3(NC) L3(NC) R3(NC) T1(NU) T2(NC) T3(NC) T10(NU) U1(NU) U2(NU) U9(NU) U10(NU)

### Buses and harness runs
bus /SDRDQS[0..7]
bus /SDRDQS[0..7] = port /SDRDQS[0..7]
bus EMMC_D[0..7] = port EMMC_D[0..7]
bus SDRA[0..15] = port SDRA[0..15]
bus SDRD[0..63]
bus SDRD[0..63] = port SDRD[0..63]
bus SDRDM[0..7]
bus SDRDM[0..7] = port SDRDM[0..7]
bus SDRDQS[0..7]
bus SDRDQS[0..7] = port SDRDQS[0..7]

### Notes on the sheet
- (near R254) N.M.
- (near C177) N.M.
- (near R169) N.M.
- (near C178) N.M.
- (near R170) N.M.
- 设   计
- 审   核
- MEMORY
- 标 准 化
- 批   准
- JEAC605UM-FTTSC-2.0
- 阶 段
- 标 记
- 第 6 张
- 共 8 张

### Library data of the parts
C15 C21-C24 C31 C85 C92-C95 C129 C131 C132 C134 C138 C141 C142 C144 C146 C149 C151-C154 C156-C175 C177 C178 = CAP: Capacitor
R9 R15 R22 R23 R28 R38 R52 R57 R58 R117 R131 R148 R149 R153 R155 R158 R161-R163 R165-R167 R169 R170 R254 R356 R589 R590 = RES1
RL5 RL10 = INDUCTOR
U7 = SDIN3C2-16G
U10 = A25L80P
U14 U15 = EDB8132B2MA

## Sheet CPU1.schdoc
size C; SheetNumber: 1; SheetTotal: 8
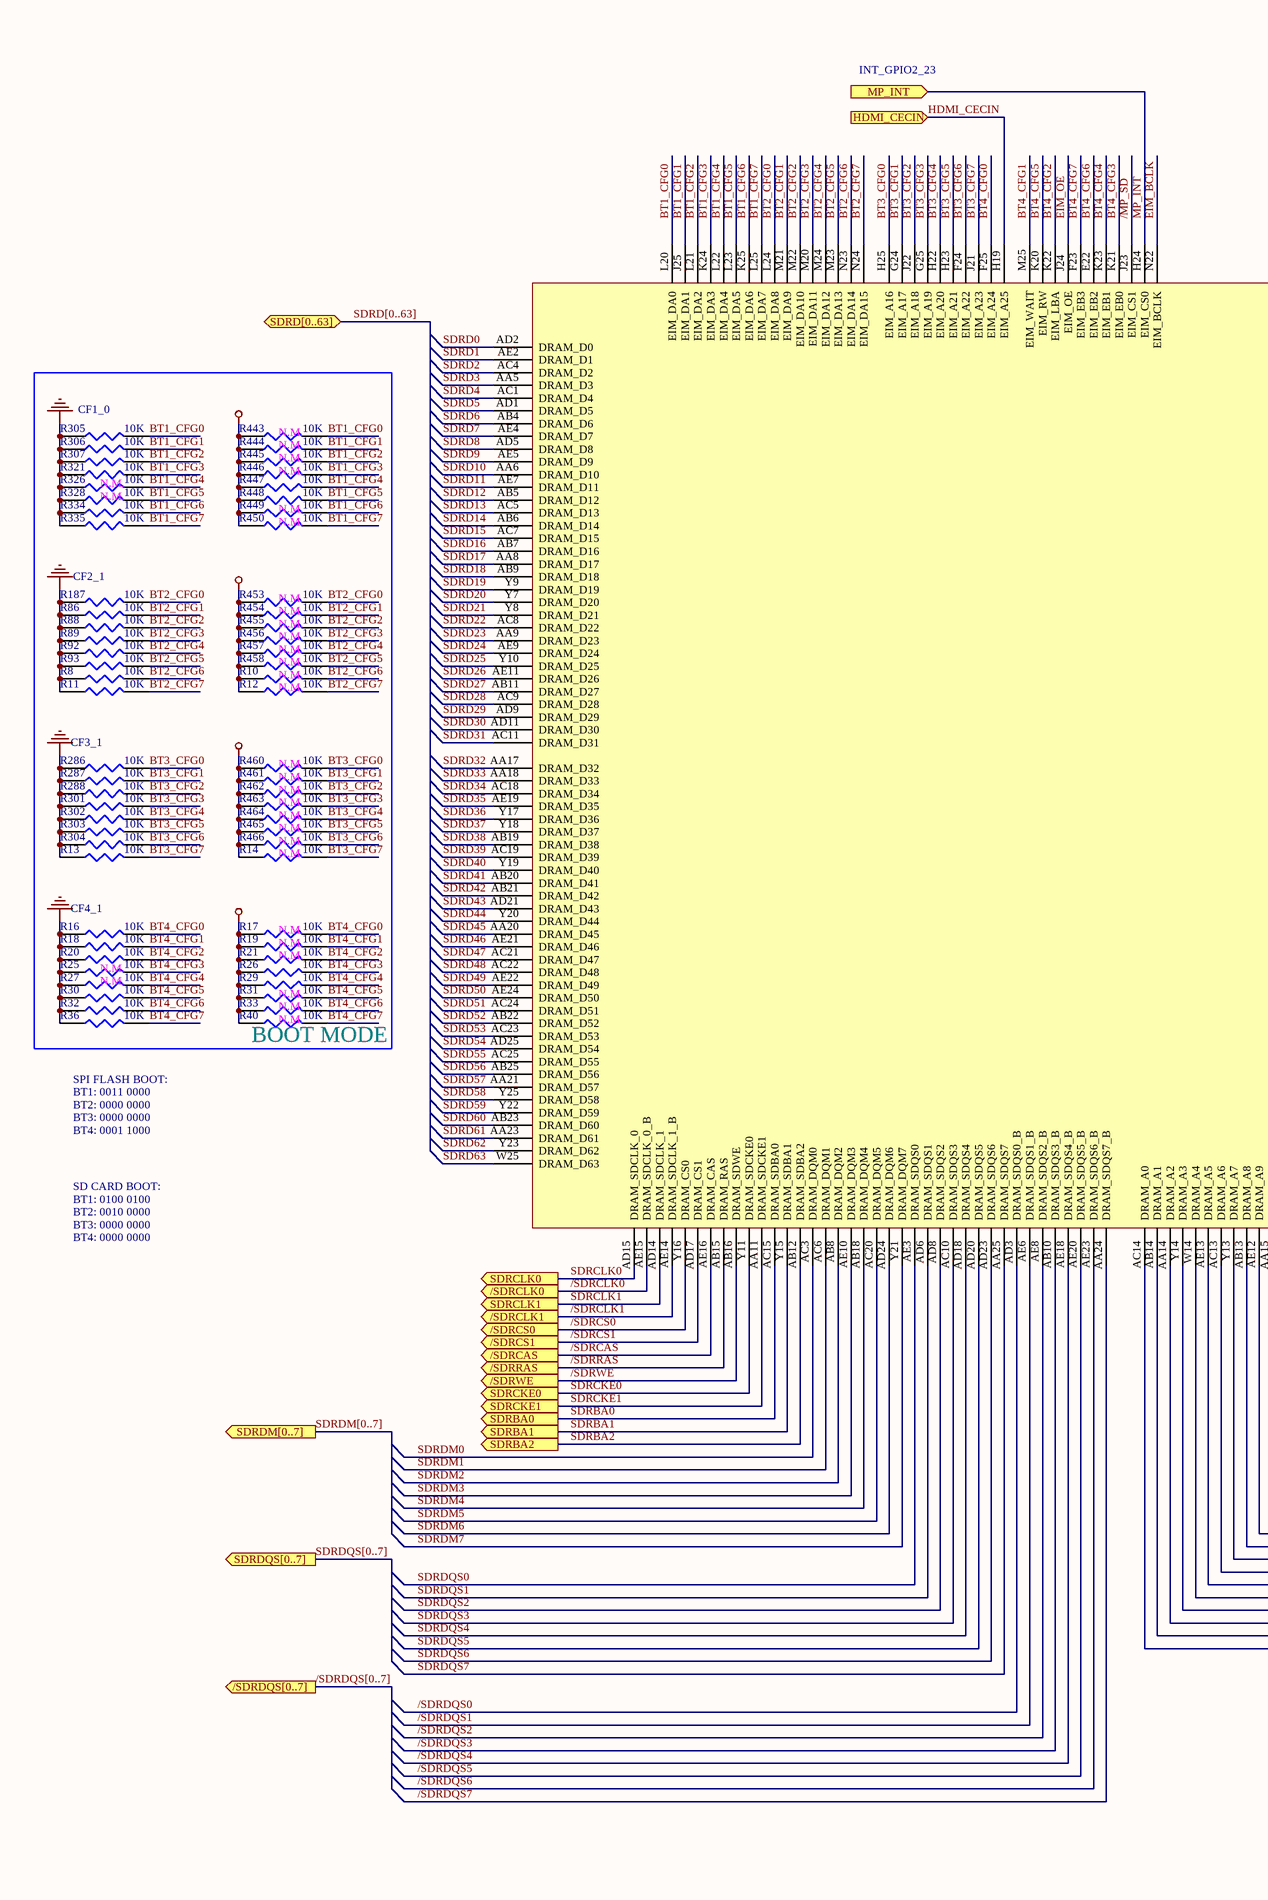
[diagram p5: CPU1.schdoc, left]
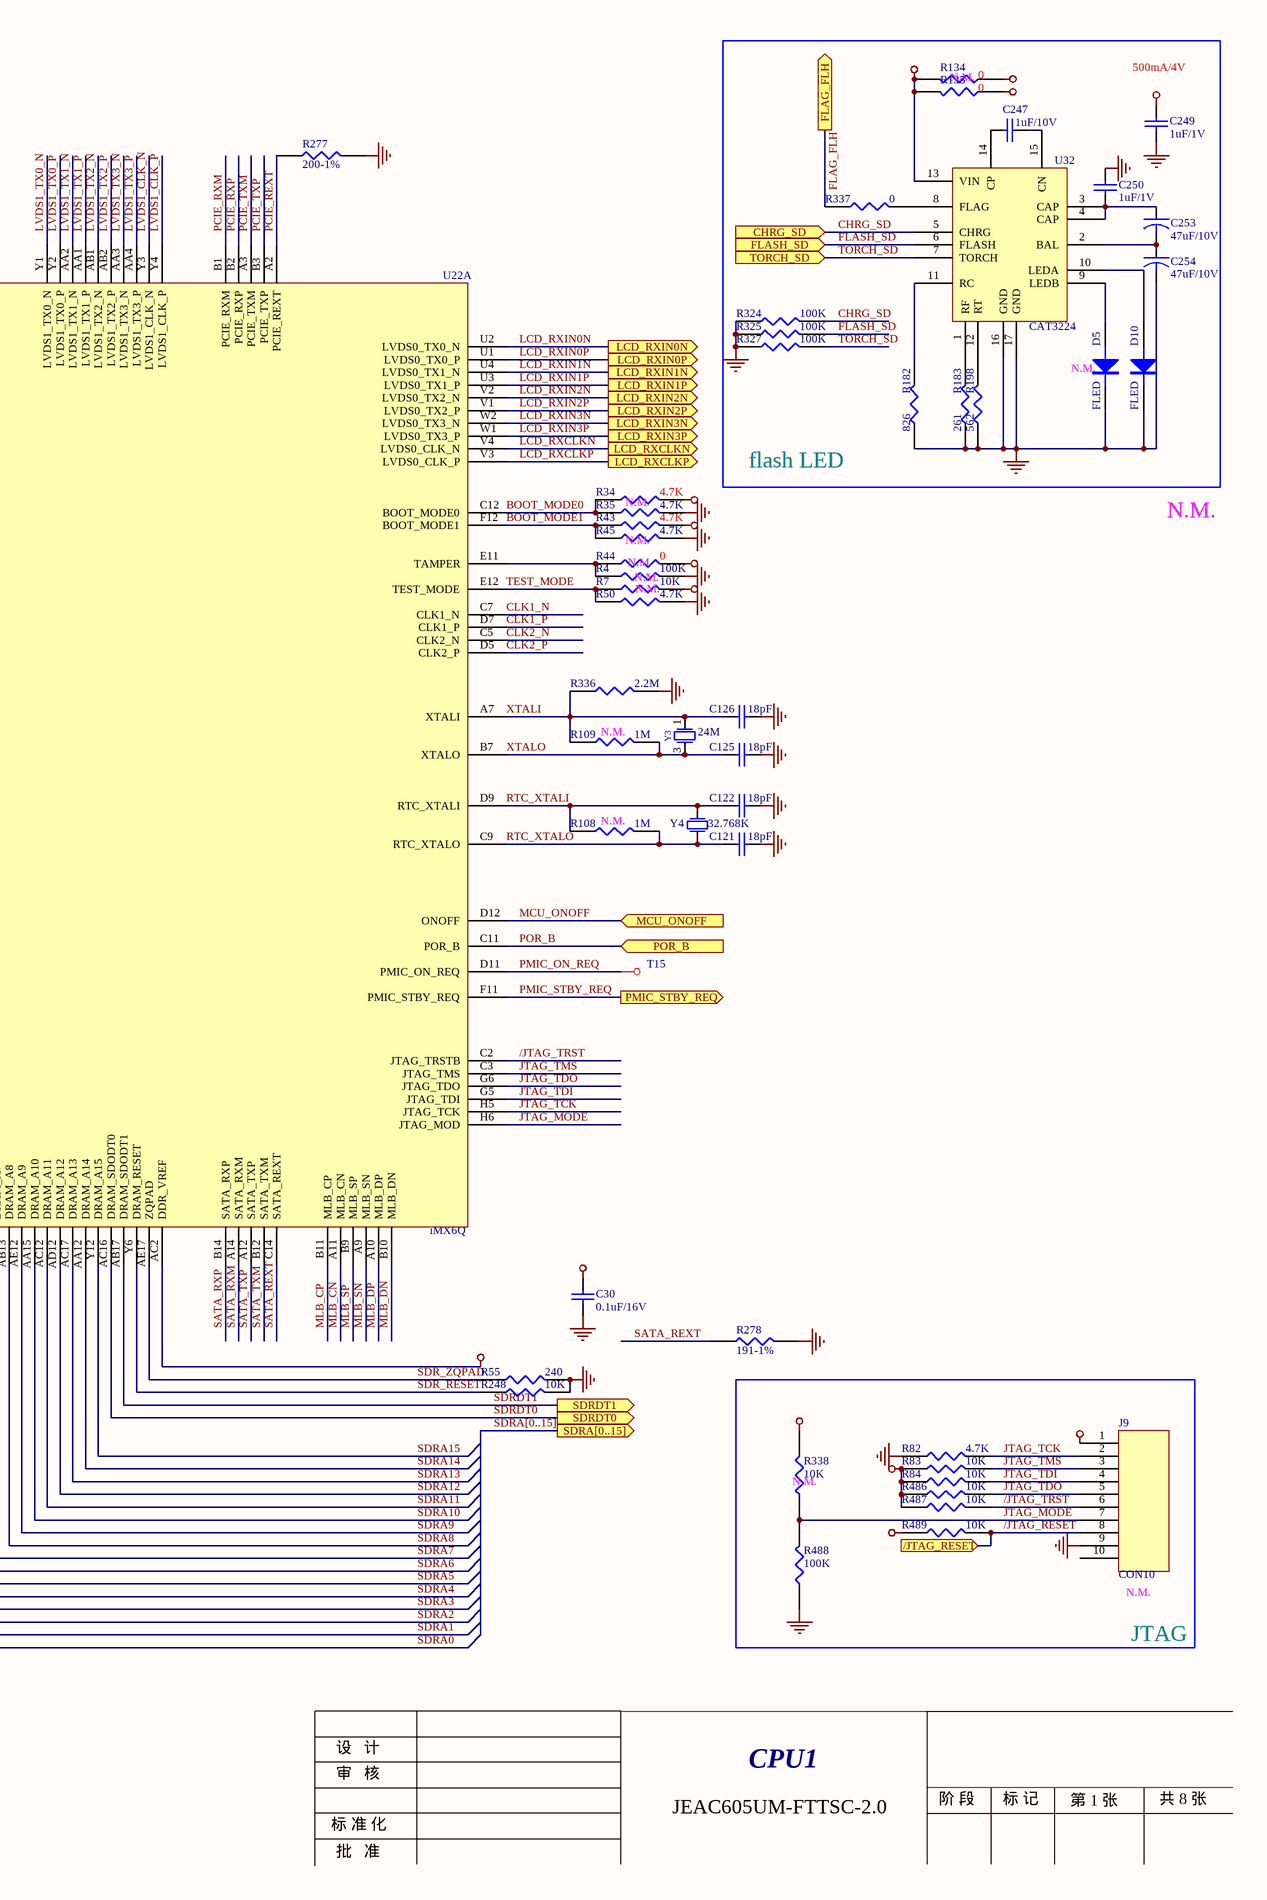
[diagram p6: CPU1.schdoc, right]

### Parts
C30  0.1uF/16V  [C0402]
C121  18pF  [C0402]
C122  18pF  [C0402]
C125  18pF  [C0402]
C126  18pF  [C0402]
C247  1uF/10V  [C0603]
C249  1uF/1V  [C0603]
C250  1uF/1V  [C0603]
C253  47uF/10V  [CASE-B]
C254  47uF/10V  [CASE-B]
D5  FLED  [R0402]
D10  FLED  [D3528]
J9  CON10  [J-CON-10-1_0]
R4  100K  [R0402]
R7  10K  [R0402]
R8  10K  [R0402]
R10  10K  [R0402]
R11  10K  [R0402]
R12  10K  [R0402]
R13  10K  [R0402]
R14  10K  [R0402]
R16  10K  [R0402]
R17  10K  [R0402]
R18  10K  [R0402]
R19  10K  [R0402]
R20  10K  [R0402]
R21  10K  [R0402]
R25  10K  [R0402]
R26  10K  [R0402]
R27  10K  [R0402]
R29  10K  [R0402]
R30  10K  [R0402]
R31  10K  [R0402]
R32  10K  [R0402]
R33  10K  [R0402]
R34  4.7K  [R0402]
R35  4.7K  [R0402]
R36  10K  [R0402]
R40  10K  [R0402]
R43  4.7K  [R0402]
R44  0  [R0402]
R45  4.7K  [R0402]
R50  4.7K  [R0402]
R55  240  [R0402]
R82  4.7K  [R0402]
R83  10K  [R0402]
R84  10K  [R0402]
R86  10K  [R0402]
R88  10K  [R0402]
R89  10K  [R0402]
R92  10K  [R0402]
R93  10K  [R0402]
R108  1M  [R0402]
R109  1M  [R0402]
R134  0  [R0603]
R135  0  [R0603]
R182  826  [R0402]
R183  261  [R0402]
R187  10K  [R0402]
R198  562  [R0402]
R248  10K  [R0402]
R277  200-1%  [R0402]
R278  191-1%  [R0402]
R286  10K  [R0402]
R287  10K  [R0402]
R288  10K  [R0402]
R301  10K  [R0402]
R302  10K  [R0402]
R303  10K  [R0402]
R304  10K  [R0402]
R305  10K  [R0402]
R306  10K  [R0402]
R307  10K  [R0402]
R321  10K  [R0402]
R324  100K  [R0402]
R325  100K  [R0402]
R326  10K  [R0402]
R327  100K  [R0402]
R328  10K  [R0402]
R334  10K  [R0402]
R335  10K  [R0402]
R336  2.2M  [R0402]
R337  0  [R0402]
R338  10K  [R0402]
R443  10K  [R0402]
R444  10K  [R0402]
R445  10K  [R0402]
R446  10K  [R0402]
R447  10K  [R0402]
R448  10K  [R0402]
R449  10K  [R0402]
R450  10K  [R0402]
R453  10K  [R0402]
R454  10K  [R0402]
R455  10K  [R0402]
R456  10K  [R0402]
R457  10K  [R0402]
R458  10K  [R0402]
R460  10K  [R0402]
R461  10K  [R0402]
R462  10K  [R0402]
R463  10K  [R0402]
R464  10K  [R0402]
R465  10K  [R0402]
R466  10K  [R0402]
R486  10K  [R0402]
R487  10K  [R0402]
R488  100K  [R0402]
R489  10K  [R0402]
T15  Testpoint  [TP0_5]  (value not drawn)
U22  iMX6Q  [U-BGA-624-0_8]  (part A of 3)
U32  CAT3224  [U-QFN-16-0_5]
Y3  24M  [Y-4-2_2-TXC-3225]
Y4  32.768K  [Y-2-XTALB]

### Blocks framed on the sheet
flash LED: C247 C249 C250 C253 C254 D5 D10 R134 R135 R182 R183 R198 R324 R325 R327 R337 U32
BOOT MODE: R8 R10-R14 R16-R21 R25-R27 R29-R33 R36 R40 R86 R88 R89 R92 R93 R187 R286-R288 R301-R307 R321 R326 R328 R334 R335 R443-R450 R453-R458 R460-R466
JTAG: J9 R82-R84 R338 R486-R489

### Ports
/JTAG_RESET (in), /SDRCAS (out), /SDRCLK0 (out), /SDRCLK1 (out), /SDRCS0 (out), /SDRCS1 (out), /SDRDQS[0..7] (out), /SDRRAS (out), /SDRWE (out), CHRG_SD (in), FLAG_FLH (out), FLASH_SD (in), HDMI_CECIN (in), LCD_RXCLKN (out), LCD_RXCLKP (out), LCD_RXIN0N (out), LCD_RXIN0P (out), LCD_RXIN1N (out), LCD_RXIN1P (out), LCD_RXIN2N (out), LCD_RXIN2P (out), LCD_RXIN3N (out), LCD_RXIN3P (out), MCU_ONOFF (in), MP_INT (in), PMIC_STBY_REQ (out), POR_B (in), SDRA[0..15] (out), SDRBA0 (out), SDRBA1 (out), SDRBA2 (out), SDRCKE0 (out), SDRCKE1 (out), SDRCLK0 (out), SDRCLK1 (out), SDRD[0..63] (bidir), SDRDM[0..7] (out), SDRDQS[0..7] (out), SDRDT0 (out), SDRDT1 (out), TORCH_SD (in)

### Nets
DRAM_VREF: C30.1 U22.AC2(DDR_VREF)
GND: C30.2 C121.1 C122.1 C125.1 C126.1 C249.1 C250.2 C254.2 D5.2 D10.2 J9.9 R4.2 R8.1 R11.1 R13.1 R16.1 R18.1 R20.1 R25.1 R27.1 R30.1 R32.1 R35.2 R36.1 R45.2 R50.2 R55.2 R82.1 R86.1 R88.1 R89.1 R92.1 R93.1 R182.1 R183.1 R187.1 R198.1 R248.2 R277.2 R278.2 R286.1 R287.1 R288.1 R301.1 R302.1 R303.1 R304.1 R305.1 R306.1 R307.1 R321.1 R324.1 R325.1 R326.1 R327.1 R328.1 R334.1 R335.1 R336.2 R488.1 U32.16(GND) U32.17(GND) Y3.2(GND) Y3.4(GND)
VCC_3V: J9.1 R10.1 R12.1 R14.1 R17.1 R19.1 R21.1 R26.1 R29.1 R31.1 R33.1 R40.1 R83.1 R84.1 R338.2 R443.1 R444.1 R445.1 R446.1 R447.1 R448.1 R449.1 R450.1 R453.1 R454.1 R455.1 R456.1 R457.1 R458.1 R460.1 R461.1 R462.1 R463.1 R464.1 R465.1 R466.1 R486.1 R487.1 R489.1
VCC_FLH: C249.2 R134.2 R135.2 U32.13(VIN)
VDD_SNVS_IN: R7.2 R34.2 R43.2 R44.2
VLI_BAT: R134.1
VMAX: R135.1
/JTAG_RESET: J9.8 R489.2 ; port /JTAG_RESET
/JTAG_TRST: J9.6 R487.2 U22.C2(JTAG_TRSTB)
/MP_SD: U22.J23(EIM_CS1)
/SDRCAS: U22.AE16(DRAM_CAS) ; port /SDRCAS
/SDRCLK0: U22.AE15(DRAM_SDCLK_0_B) ; port /SDRCLK0
/SDRCLK1: U22.AE14(DRAM_SDCLK_1_B) ; port /SDRCLK1
/SDRCS0: U22.Y16(DRAM_CS0) ; port /SDRCS0
/SDRCS1: U22.AD17(DRAM_CS1) ; port /SDRCS1
/SDRDQS0: U22.AD3(DRAM_SDQS0_B)
/SDRDQS1: U22.AE6(DRAM_SDQS1_B)
/SDRDQS2: U22.AE8(DRAM_SDQS2_B)
/SDRDQS3: U22.AB10(DRAM_SDQS3_B)
/SDRDQS4: U22.AE18(DRAM_SDQS4_B)
/SDRDQS5: U22.AE20(DRAM_SDQS5_B)
/SDRDQS6: U22.AE23(DRAM_SDQS6_B)
/SDRDQS7: U22.AA24(DRAM_SDQS7_B)
/SDRRAS: U22.AB15(DRAM_RAS) ; port /SDRRAS
/SDRWE: U22.AB16(DRAM_SDWE) ; port /SDRWE
BOOT_MODE0: R34.1 R35.1 U22.C12(BOOT_MODE0)
BOOT_MODE1: R43.1 R45.1 U22.F12(BOOT_MODE1)
BT1_CFG0: R305.2 R443.2 U22.L20(EIM_DA0)
BT1_CFG1: R306.2 R444.2 U22.J25(EIM_DA1)
BT1_CFG2: R307.2 R445.2 U22.L21(EIM_DA2)
BT1_CFG3: R321.2 R446.2 U22.K24(EIM_DA3)
BT1_CFG4: R326.2 R447.2 U22.L22(EIM_DA4)
BT1_CFG5: R328.2 R448.2 U22.L23(EIM_DA5)
BT1_CFG6: R334.2 R449.2 U22.K25(EIM_DA6)
BT1_CFG7: R335.2 R450.2 U22.L25(EIM_DA7)
BT2_CFG0: R187.2 R453.2 U22.L24(EIM_DA8)
BT2_CFG1: R86.2 R454.2 U22.M21(EIM_DA9)
BT2_CFG2: R88.2 R455.2 U22.M22(EIM_DA10)
BT2_CFG3: R89.2 R456.2 U22.M20(EIM_DA11)
BT2_CFG4: R92.2 R457.2 U22.M24(EIM_DA12)
BT2_CFG5: R93.2 R458.2 U22.M23(EIM_DA13)
BT2_CFG6: R8.2 R10.2 U22.N23(EIM_DA14)
BT2_CFG7: R11.2 R12.2 U22.N24(EIM_DA15)
BT3_CFG0: R286.2 R460.2 U22.H25(EIM_A16)
BT3_CFG1: R287.2 R461.2 U22.G24(EIM_A17)
BT3_CFG2: R288.2 R462.2 U22.J22(EIM_A18)
BT3_CFG3: R301.2 R463.2 U22.G25(EIM_A19)
BT3_CFG4: R302.2 R464.2 U22.H22(EIM_A20)
BT3_CFG5: R303.2 R465.2 U22.H23(EIM_A21)
BT3_CFG6: R304.2 R466.2 U22.F24(EIM_A22)
BT3_CFG7: R13.2 R14.2 U22.J21(EIM_A23)
BT4_CFG0: R16.2 R17.2 U22.F25(EIM_A24)
BT4_CFG1: R18.2 R19.2 U22.M25(EIM_WAIT)
BT4_CFG2: R20.2 R21.2 U22.K22(EIM_LBA)
BT4_CFG3: R25.2 R26.2 U22.K21(EIM_EB0)
BT4_CFG4: R27.2 R29.2 U22.K23(EIM_EB1)
BT4_CFG5: R30.2 R31.2 U22.K20(EIM_RW)
BT4_CFG6: R32.2 R33.2 U22.E22(EIM_EB2)
BT4_CFG7: R36.2 R40.2 U22.F23(EIM_EB3)
CHRG_SD: R324.2 U32.5(CHRG) ; port CHRG_SD
CLK1_N: U22.C7(CLK1_N)
CLK1_P: U22.D7(CLK1_P)
CLK2_N: U22.C5(CLK2_N)
CLK2_P: U22.D5(CLK2_P)
EIM_BCLK: U22.N22(EIM_BCLK)
EIM_OE: U22.J24(EIM_OE)
FLAG_FLH: R337.1 ; port FLAG_FLH
FLASH_SD: R325.2 U32.6(FLASH) ; port FLASH_SD
HDMI_CECIN: U22.H19(EIM_A25) ; port HDMI_CECIN
JTAG_MODE: J9.7 R338.1 R488.2 U22.H6(JTAG_MOD)
JTAG_TCK: J9.2 R82.2 U22.H5(JTAG_TCK)
JTAG_TDI: J9.4 R84.2 U22.G5(JTAG_TDI)
JTAG_TDO: J9.5 R486.2 U22.G6(JTAG_TDO)
JTAG_TMS: J9.3 R83.2 U22.C3(JTAG_TMS)
LCD_RXCLKN: U22.V4(LVDS0_CLK_N) ; port LCD_RXCLKN
LCD_RXCLKP: U22.V3(LVDS0_CLK_P) ; port LCD_RXCLKP
LCD_RXIN0N: U22.U2(LVDS0_TX0_N) ; port LCD_RXIN0N
LCD_RXIN0P: U22.U1(LVDS0_TX0_P) ; port LCD_RXIN0P
LCD_RXIN1N: U22.U4(LVDS0_TX1_N) ; port LCD_RXIN1N
LCD_RXIN1P: U22.U3(LVDS0_TX1_P) ; port LCD_RXIN1P
LCD_RXIN2N: U22.V2(LVDS0_TX2_N) ; port LCD_RXIN2N
LCD_RXIN2P: U22.V1(LVDS0_TX2_P) ; port LCD_RXIN2P
LCD_RXIN3N: U22.W2(LVDS0_TX3_N) ; port LCD_RXIN3N
LCD_RXIN3P: U22.W1(LVDS0_TX3_P) ; port LCD_RXIN3P
LVDS1_CLK_N: U22.Y3(LVDS1_CLK_N)
LVDS1_CLK_P: U22.Y4(LVDS1_CLK_P)
LVDS1_TX0_N: U22.Y1(LVDS1_TX0_N)
LVDS1_TX0_P: U22.Y2(LVDS1_TX0_P)
LVDS1_TX1_N: U22.AA2(LVDS1_TX1_N)
LVDS1_TX1_P: U22.AA1(LVDS1_TX1_P)
LVDS1_TX2_N: U22.AB1(LVDS1_TX2_N)
LVDS1_TX2_P: U22.AB2(LVDS1_TX2_P)
LVDS1_TX3_N: U22.AA3(LVDS1_TX3_N)
LVDS1_TX3_P: U22.AA4(LVDS1_TX3_P)
MCU_ONOFF: U22.D12(ONOFF) ; port MCU_ONOFF
MLB_CN: U22.A11(MLB_CN)
MLB_CP: U22.B11(MLB_CP)
MLB_DN: U22.B10(MLB_DN)
MLB_DP: U22.A10(MLB_DP)
MLB_SN: U22.A9(MLB_SN)
MLB_SP: U22.B9(MLB_SP)
MP_INT: U22.H24(EIM_CS0) ; port MP_INT
PCIE_REXT: R277.1 U22.A2(PCIE_REXT)
PCIE_RXM: U22.B1(PCIE_RXM)
PCIE_RXP: U22.B2(PCIE_RXP)
PCIE_TXM: U22.A3(PCIE_TXM)
PCIE_TXP: U22.B3(PCIE_TXP)
PMIC_ON_REQ: T15.1(TP) U22.D11(PMIC_ON_REQ)
PMIC_STBY_REQ: U22.F11(PMIC_STBY_REQ) ; port PMIC_STBY_REQ
POR_B: U22.C11(POR_B) ; port POR_B
RTC_XTALI: C122.2 R108.1 U22.D9(RTC_XTALI) Y4.2(P2)
RTC_XTALO: C121.2 R108.2 U22.C9(RTC_XTALO) Y4.1(P1)
SATA_REXT: R278.1 U22.C14(SATA_REXT)
SATA_RXM: U22.A14(SATA_RXM)
SATA_RXP: U22.B14(SATA_RXP)
SATA_TXM: U22.B12(SATA_TXM)
SATA_TXP: U22.A12(SATA_TXP)
SDR_RESET: R248.1 U22.Y6(DRAM_RESET)
SDR_ZQPAD: R55.1 U22.AE17(ZQPAD)
SDRA0: U22.AC14(DRAM_A0)
SDRA1: U22.AB14(DRAM_A1)
SDRA2: U22.AA14(DRAM_A2)
SDRA3: U22.Y14(DRAM_A3)
SDRA4: U22.W14(DRAM_A4)
SDRA5: U22.AE13(DRAM_A5)
SDRA6: U22.AC13(DRAM_A6)
SDRA7: U22.Y13(DRAM_A7)
SDRA8: U22.AB13(DRAM_A8)
SDRA9: U22.AE12(DRAM_A9)
SDRA10: U22.AA15(DRAM_A10)
SDRA11: U22.AC12(DRAM_A11)
SDRA12: U22.AD12(DRAM_A12)
SDRA13: U22.AC17(DRAM_A13)
SDRA14: U22.AA12(DRAM_A14)
SDRA15: U22.Y12(DRAM_A15)
SDRBA0: U22.AC15(DRAM_SDBA0) ; port SDRBA0
SDRBA1: U22.Y15(DRAM_SDBA1) ; port SDRBA1
SDRBA2: U22.AB12(DRAM_SDBA2) ; port SDRBA2
SDRCKE0: U22.Y11(DRAM_SDCKE0) ; port SDRCKE0
SDRCKE1: U22.AA11(DRAM_SDCKE1) ; port SDRCKE1
SDRCLK0: U22.AD15(DRAM_SDCLK_0) ; port SDRCLK0
SDRCLK1: U22.AD14(DRAM_SDCLK_1) ; port SDRCLK1
SDRD0: U22.AD2(DRAM_D0)
SDRD1: U22.AE2(DRAM_D1)
SDRD2: U22.AC4(DRAM_D2)
SDRD3: U22.AA5(DRAM_D3)
SDRD4: U22.AC1(DRAM_D4)
SDRD5: U22.AD1(DRAM_D5)
SDRD6: U22.AB4(DRAM_D6)
SDRD7: U22.AE4(DRAM_D7)
SDRD8: U22.AD5(DRAM_D8)
SDRD9: U22.AE5(DRAM_D9)
SDRD10: U22.AA6(DRAM_D10)
SDRD11: U22.AE7(DRAM_D11)
SDRD12: U22.AB5(DRAM_D12)
SDRD13: U22.AC5(DRAM_D13)
SDRD14: U22.AB6(DRAM_D14)
SDRD15: U22.AC7(DRAM_D15)
SDRD16: U22.AB7(DRAM_D16)
SDRD17: U22.AA8(DRAM_D17)
SDRD18: U22.AB9(DRAM_D18)
SDRD19: U22.Y9(DRAM_D19)
SDRD20: U22.Y7(DRAM_D20)
SDRD21: U22.Y8(DRAM_D21)
SDRD22: U22.AC8(DRAM_D22)
SDRD23: U22.AA9(DRAM_D23)
SDRD24: U22.AE9(DRAM_D24)
SDRD25: U22.Y10(DRAM_D25)
SDRD26: U22.AE11(DRAM_D26)
SDRD27: U22.AB11(DRAM_D27)
SDRD28: U22.AC9(DRAM_D28)
SDRD29: U22.AD9(DRAM_D29)
SDRD30: U22.AD11(DRAM_D30)
SDRD31: U22.AC11(DRAM_D31)
SDRD32: U22.AA17(DRAM_D32)
SDRD33: U22.AA18(DRAM_D33)
SDRD34: U22.AC18(DRAM_D34)
SDRD35: U22.AE19(DRAM_D35)
SDRD36: U22.Y17(DRAM_D36)
SDRD37: U22.Y18(DRAM_D37)
SDRD38: U22.AB19(DRAM_D38)
SDRD39: U22.AC19(DRAM_D39)
SDRD40: U22.Y19(DRAM_D40)
SDRD41: U22.AB20(DRAM_D41)
SDRD42: U22.AB21(DRAM_D42)
SDRD43: U22.AD21(DRAM_D43)
SDRD44: U22.Y20(DRAM_D44)
SDRD45: U22.AA20(DRAM_D45)
SDRD46: U22.AE21(DRAM_D46)
SDRD47: U22.AC21(DRAM_D47)
SDRD48: U22.AC22(DRAM_D48)
SDRD49: U22.AE22(DRAM_D49)
SDRD50: U22.AE24(DRAM_D50)
SDRD51: U22.AC24(DRAM_D51)
SDRD52: U22.AB22(DRAM_D52)
SDRD53: U22.AC23(DRAM_D53)
SDRD54: U22.AD25(DRAM_D54)
SDRD55: U22.AC25(DRAM_D55)
SDRD56: U22.AB25(DRAM_D56)
SDRD57: U22.AA21(DRAM_D57)
SDRD58: U22.Y25(DRAM_D58)
SDRD59: U22.Y22(DRAM_D59)
SDRD60: U22.AB23(DRAM_D60)
SDRD61: U22.AA23(DRAM_D61)
SDRD62: U22.Y23(DRAM_D62)
SDRD63: U22.W25(DRAM_D63)
SDRDM0: U22.AC3(DRAM_DQM0)
SDRDM1: U22.AC6(DRAM_DQM1)
SDRDM2: U22.AB8(DRAM_DQM2)
SDRDM3: U22.AE10(DRAM_DQM3)
SDRDM4: U22.AB18(DRAM_DQM4)
SDRDM5: U22.AC20(DRAM_DQM5)
SDRDM6: U22.AD24(DRAM_DQM6)
SDRDM7: U22.Y21(DRAM_DQM7)
SDRDQS0: U22.AE3(DRAM_SDQS0)
SDRDQS1: U22.AD6(DRAM_SDQS1)
SDRDQS2: U22.AD8(DRAM_SDQS2)
SDRDQS3: U22.AC10(DRAM_SDQS3)
SDRDQS4: U22.AD18(DRAM_SDQS4)
SDRDQS5: U22.AD20(DRAM_SDQS5)
SDRDQS6: U22.AD23(DRAM_SDQS6)
SDRDQS7: U22.AA25(DRAM_SDQS7)
SDRDT0: U22.AC16(DRAM_SDODT0) ; port SDRDT0
SDRDT1: U22.AB17(DRAM_SDODT1) ; port SDRDT1
TEST_MODE: R7.1 R50.1 U22.E12(TEST_MODE)
TORCH_SD: R327.2 U32.7(TORCH) ; port TORCH_SD
XTALI: C126.2 R109.1 R336.1 U22.A7(XTALI) Y3.1(P1)
XTALO: C125.2 R109.2 U22.B7(XTALO) Y3.3(P2)
NetC247_1: C247.1 U32.14(CP)
NetC247_2: C247.2 U32.15(CN)
NetC250_1: C250.1 C253.1 U32.3(CAP) U32.4(CAP)
NetC253_2: C253.2 C254.1 U32.2(BAL)
NetD5_1: D5.1 U32.9(LEDB)
NetD10_1: D10.1 U32.10(LEDA)
NetR4_1: R4.1 R44.1 U22.E11(TAMPER)
NetR182_2: R182.2 U32.11(RC)
NetR183_2: R183.2 U32.1(RF)
NetR198_2: R198.2 U32.12(RT)
NetR337_2: R337.2 U32.8(FLAG)

Not connected (* = marked no-connect by the designer): J9 10

### Buses and harness runs
bus /SDRDQS[0..7] = port /SDRDQS[0..7]
bus SDRA[0..15] = port SDRA[0..15]
bus SDRD[0..63] = port SDRD[0..63]
bus SDRDM[0..7] = port SDRDM[0..7]
bus SDRDQS[0..7] = port SDRDQS[0..7]

### Notes on the sheet
- INT_GPIO2_23
- (near C249) 500mA/4V
- (near R134) N.M.
- (near D5) N.M.
- CF1_0
- N.M.
- (near R443) N.M.
- CF2_1
- (near R45) N.M.
- (near R44) N.M.
- (near R453) N.M.
- (near R7) N.M.
- CF3_1
- (near R460) N.M.
- (near R109) N.M.
- (near R108) N.M.
- CF4_1
- (near R17) N.M.
- SPI FLASH BOOT:
- BT1: 0011 0000
- BT2: 0000 0000
- BT3: 0000 0000
- BT4: 0001 1000
- SD CARD BOOT:
- BT1: 0100 0100
- BT2: 0010 0000
- BT4: 0000 0000
- (near R338) N.M.
- (near J9) N.M.
- 设   计
- 审   核
- CPU1
- 标 准 化
- 批   准
- JEAC605UM-FTTSC-2.0
- 阶 段
- 标 记
- 第 1 张
- 共 8 张

### Library data of the parts
C30 C121 C122 C125 C126 C247 C249 C250 = CAP: Capacitor
C253 C254 = CAPACITOR
D5 D10 = DIODE
R4 R7 R8 R10-R14 R16-R21 R25-R27 R29-R36 R40 R43-R45 R50 R55 R82-R84 R86 R88 R89 R92 R93 R108 R109 R134 R135 R182 R183 R187 R198 R248 R277 R278 R286-R288 R301-R307 R321 R324-R328 R334-R338 R443-R450 R453-R458 R460-R466 R486-R489 = RES1
U22 = IMX6Q: pin to pad: A4>132 A5>U12 A8>133 A12>A10 A13>130 A14>A12 A15>F17 A16>83 A17>85 A19>91 A25>131 AA7>139 AA16>136 AA22>138 AA23>72 AA24>Y23 AA25>Y22 AB3>141 AB24>140 AB25>67 AC24>62 AC25>66 AD1>G23 AD2>H20 AD3>H22 AD4>147 AD5>E21 AD6>D23 AD7>148 AD8>T22 AD9>V23 AD10>142 AD11>AA22 AD12>L20 AD13>143 AD14>P22 AD15>K23 AD16>144 AD17>P19 AD18>H23 AD19>145 AD20>D23 AD21>54 AD22>146 AD23>T22 AD24>77 AD25>65 AE1>149 AE2>G21 AE3>H23 AE4>G22 AE5>D21 AE6>D22 AE7>D20 AE8>T23 AE9>Y20 AE10>W20 AE11>Y21 AE12>M21 AE13>N21 AE14>P23 AE15>K22 AE16>L18 AE17>M23 AE18>H22 AE19>46 AE20>D22 AE21>57 AE22>60 AE23>T23 AE24>61 AE25>150 B4>151 B5>170 B12>B10 B14>B12 B15>F16 B16>86 C1>152 C2>E15 C3>A8 C4>154 C6>155 C8>F9 C10>153 C12>94 C13>C20 C15>84 C16>84 C17>88 C25>U6 D3>156 D6>157 D8>158 D13>A21 D14>E16 D16>86 D17>90 D24>V1 D25>Y1 E5>159 E6>160 E7>161 E8>215 E13>E19 E14>A20 E15>85 E17>93 E20>C14 E22>Y3 E23>W2 E24>V5 E25>V4 F5>162 F6>163 F7>164 F12>B20 F15>83 F16>89 F23>Y4 F24>AA3 F25>Y5 G3>168 G5>C16 G6>W23 G10>166 G11>279 G14>H14 G15>209 G17>237 G19>167 G20>W1 G21>V2 G22>W3 G23>AA1 G24>V7 G25>W7 H5>73 H6>70 H8>172 H9>277 H10>296 H11>259 H12>169 H13>244 H16>267 H17>287 H18>171 H19>W6 H20>V3 H21>W5 H22>P18 H23>AA4 H24>W8 H25>G20 J4>D14 J5>F18 J7>298 J8>177 J9>278 J10>297 J11>260 J12>173 J13>245 J14>238 J15>174 J16>268 J17>288 J18>175 J19>AA2 J21>V6 J22>AB3 J23>Y7 J24>V8 J25>J21 K7>D13 K8>182 K9>251 K10>178 K11>261 K12>179 K13>246 K14>239 K15>180 K16>269 K17>289 K18>181 K19>258 K20>AB4 K22>AA6 K23>AB5 K24>W9 K25>R21 L7>M7 L8>189 L9>252 L10>183 L11>262 L13>247 L14>240 L15>185 L16>270 L17>290 L18>186 L19>U9 L20>R22 L21>AA7 L22>F23 L23>V9 L24>T21 L25>C23 M8>194 M9>253 M10>190 M11>263 M12>191 M13>248 M14>241 M15>192 M16>271 M17>291 M18>193 M19>U9 M20>E20 M21>W10 M22>U20 M23>C22 M24>V10 M25>AB9 N7>B19 N8>198 N9>254 N10>195 N11>264 N12>294 N13>249 N14>242 N15>196 N16>272 N17>292 N18>197 N19>R2 N20>C2 N21>E4 N22>W11 N23>W21 N24>R23 N25>D3 P7>165 P8>203 P9>255 P10>199 P11>265 P12>200 P13>250 P14>243 P15>201 P16>273 P17>293 P18>202 P19>J7 P20>R6 P22>J4 P23>N4 P24>J5 P25>D2 R1>A3 R2>C6 R3>A4 R4>A5 R5>B5 R6>D8 R8>207 R9>256 R10>280 R11>266 R12>204 R13>250 R14>243 R15>205 R16>274 R17>206 R18>28 R19>E7 R21>G3 R22>G6 R23>R3 R24>H6 R25>R1 T1>B21 T2>E8 T3>A19 T4>W22 T5>C8 T6>E5 T8>213 T9>257 T10>281 T11>208 T13>282 T14>283 T15>210 T16>275 T17>211 T18>29 T19>212 T20>C1 T21>D1 T22>F3 T23>H5 T24>N3 T25>E2 U1>AB14 U2>AC14 U3>AB13 U4>AC13 U5>F6 U6>D6 U8>218 U10>284 U13>285 U14>286 U15>216 U18>30 U19>219 U20>D17 U21>K20 U22>F4 U23>G5 U24>F5 U25>F2 V1>AB12 V2>AC12 V3>Y13 V4>AA13 V5>E6 V6>B3 V8>220 V9>40 V10>31 V11>32 V12>33 V13>34 V14>35 V15>36 V16>37 V17>38 V18>39 V19>221 V23>A21 V24>E3 V25>U1 W1>Y12 W2>AA12 W3>222 W4>D18 W5>B21 W6>C4 W7>223 W8>224 W9>225 W10>226 W11>227 W15>230 W16>231 W17>232 W18>233 W19>234 W20>B17 W21>D15 W22>C19 W23>F12 W24>C3 W25>74 Y5>235 Y20>55 Y21>78 Y24>236 Y25>69
Y3 = 12M: Crystal Oscillator
Y4 = 32.768kHZ: Crystal Oscillator